# Altium project mini_greenhouse_hardware.PrjPcb
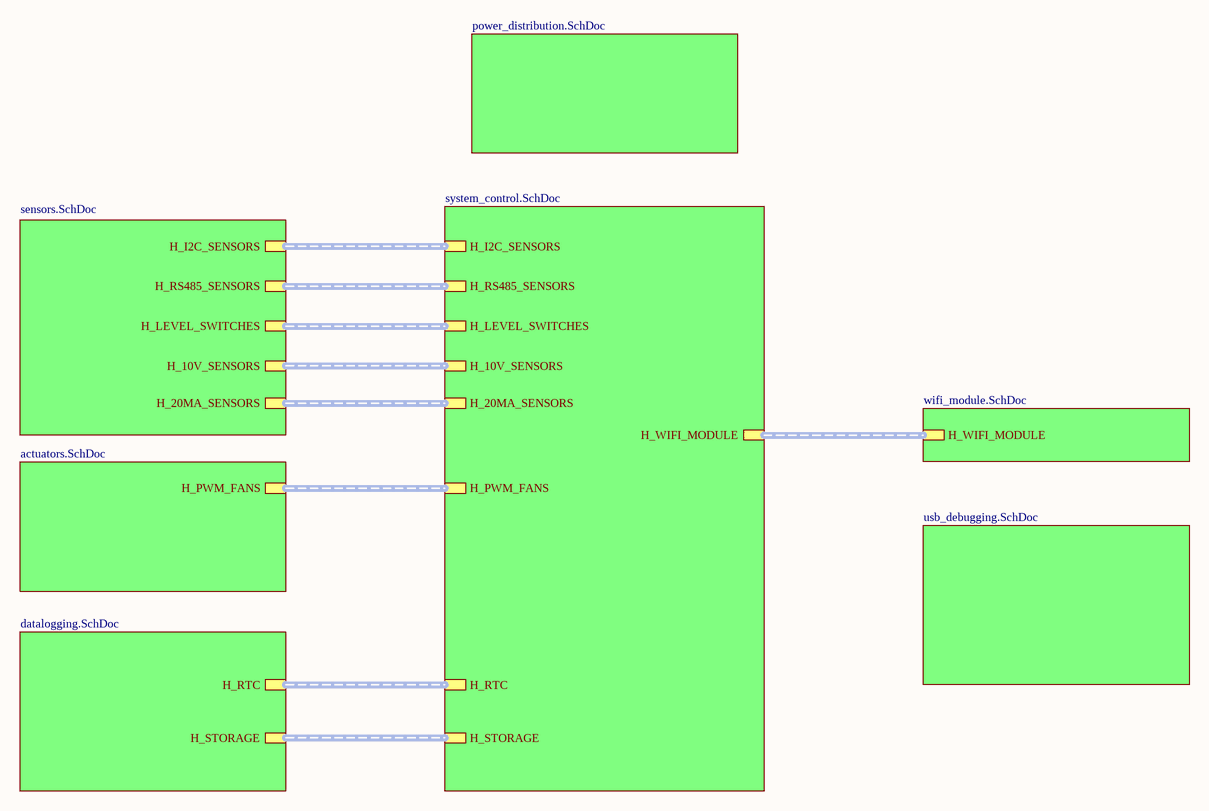
[diagram p0: main.SchDoc]
13 sheets, 113 parts. Net scope: hierarchical (ports join the sheet entries above them; power ports are global).
Sheets:
  main.SchDoc
    system_control = system_control.SchDoc
      mcu_core = mcu_core.SchDoc
    sensors = sensors.SchDoc
      soil_moisture_sensors = rs485_sensors.SchDoc
      level_switches = level_switches.SchDoc
      soil_moisture_sensors = i2c_sensors.SchDoc
      level_switches = analog_10V_sensors.SchDoc
      level_switches = analog_20mA_sensors.SchDoc
    wifi_module = wifi_module.SchDoc
    actuators = actuators.SchDoc
      pwm_fan_controller = pwm_fan_controller.SchDoc
    datalogging = datalogging.SchDoc

## Sheet main.SchDoc
size A4; SheetNumber: 1; SheetTotal: 13

### Sub-sheets
actuators = actuators.SchDoc: H_PWM_FANS (harness H_PWM_FANS)
datalogging = datalogging.SchDoc: H_RTC (harness H_RTC), H_STORAGE (harness H_STORAGE)
power_distribution = power_distribution.SchDoc (file not in this document): no entries
sensors = sensors.SchDoc: H_I2C_SENSORS (harness H_I2C_SENSORS), H_LEVEL_SWITCHES (harness H_LEVEL_SENSORS), H_RS485_SENSORS, H_10V_SENSORS (harness H_ANALOG_SENSORS), H_20MA_SENSORS (harness H_ANALOG_SENSORS)
system_control = system_control.SchDoc: H_I2C_SENSORS (harness H_I2C_SENSORS), H_LEVEL_SWITCHES (harness H_LEVEL_SWITCHES), H_RTC (harness H_RTC), H_STORAGE (harness H_STORAGE), H_RS485_SENSORS (harness H_RS485_SENSORS), H_10V_SENSORS (harness H_10V_SENSORS), H_20MA_SENSORS (harness H_20MA_SENSORS), H_PWM_FANS (harness H_PWM_FANS), H_WIFI_MODULE (harness H_WIFI_MODULE)
usb_debugging = usb_debugging.SchDoc (file not in this document): no entries
wifi_module = wifi_module.SchDoc: H_WIFI_MODULE (harness H_WIFI_MODULE)

### Buses and harness runs
harness sheet actuators/H_PWM_FANS = sheet system_control/H_PWM_FANS
harness sheet datalogging/H_RTC = sheet system_control/H_RTC
harness sheet datalogging/H_STORAGE = sheet system_control/H_STORAGE
harness sheet sensors/H_10V_SENSORS = sheet system_control/H_10V_SENSORS
harness sheet sensors/H_20MA_SENSORS = sheet system_control/H_20MA_SENSORS
harness sheet sensors/H_I2C_SENSORS = sheet system_control/H_I2C_SENSORS
harness sheet sensors/H_LEVEL_SWITCHES = sheet system_control/H_LEVEL_SWITCHES
harness sheet sensors/H_RS485_SENSORS = sheet system_control/H_RS485_SENSORS
harness sheet system_control/H_WIFI_MODULE = sheet wifi_module/H_WIFI_MODULE

## Sheet system_control.SchDoc
size A4; SheetNumber: 2; SheetTotal: 13
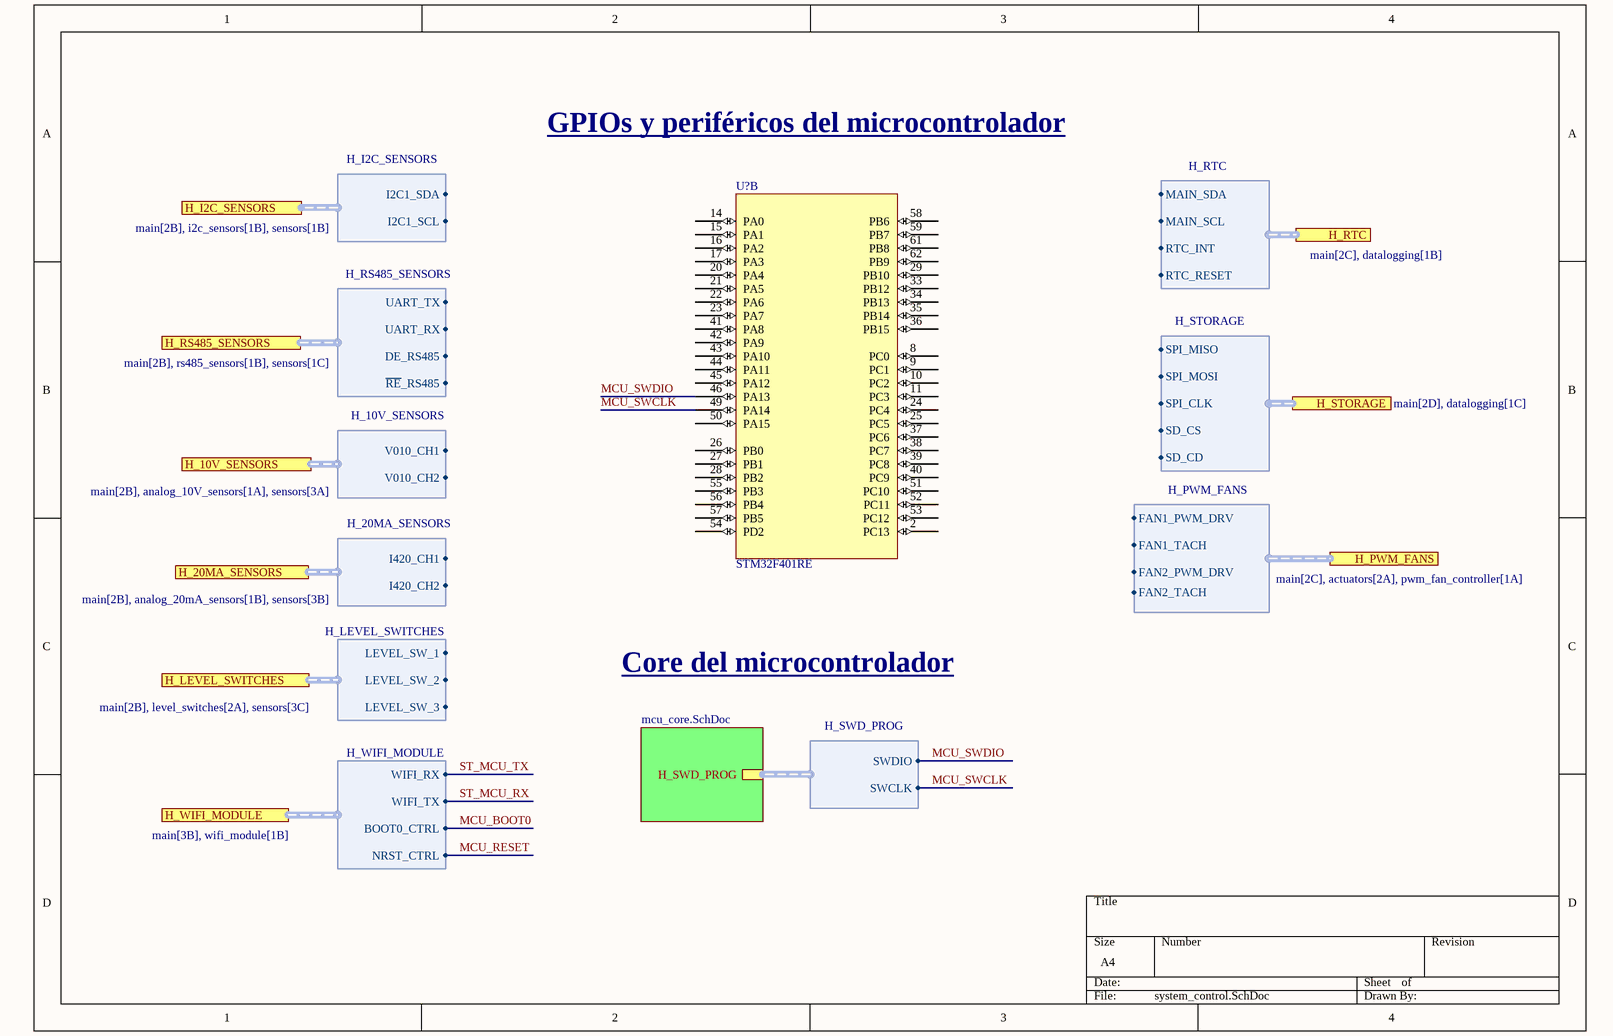
[diagram p1: system_control.SchDoc]

### Parts
(Parts that share a designator on the sheet are numbered #1, #2 ... from top to bottom, then left to right.)
U?#1  STM32F401RE  [FP-LQFP64-5W-IPC_B]  (part B of 2)

### Sub-sheets
mcu_core = mcu_core.SchDoc: H_SWD_PROG (harness H_SWD_PROG)

### Ports
H_10V_SENSORS (harness H_10V_SENSORS, see main[2B], analog_10V_sensors[1A], sensors[3A]), H_20MA_SENSORS (harness H_20MA_SENSORS, see main[2B], analog_20mA_sensors[1B], sensors[3B]), H_I2C_SENSORS (harness H_I2C_SENSORS, see main[2B], i2c_sensors[1B], sensors[1B]), H_LEVEL_SWITCHES (harness H_LEVEL_SWITCHES, see main[2B], level_switches[2A], sensors[3C]), H_PWM_FANS (harness H_PWM_FANS, see main[2C], actuators[2A], pwm_fan_controller[1A]), H_RS485_SENSORS (harness H_RS485_SENSORS, see main[2B], rs485_sensors[1B], sensors[1C]), H_RTC (harness H_RTC, see main[2C], datalogging[1B]), H_STORAGE (harness H_STORAGE, see main[2D], datalogging[1C]), H_WIFI_MODULE (harness H_WIFI_MODULE, see main[3B], wifi_module[1B])

### Harnesses
H_I2C_SENSORS: I2C1_SDA, I2C1_SCL
H_LEVEL_SWITCHES: LEVEL_SW_1, LEVEL_SW_2, LEVEL_SW_3
H_SWD_PROG: SWDIO, SWCLK
H_RTC: MAIN_SDA, MAIN_SCL, RTC_INT, RTC_RESET
H_STORAGE: SPI_MISO, SPI_MOSI, SPI_CLK, SD_CS, SD_CD
H_RS485_SENSORS: UART_TX, UART_RX, DE_RS485, ~{RE}_RS485
H_10V_SENSORS: V010_CH1, V010_CH2
H_20MA_SENSORS: I420_CH1, I420_CH2
H_PWM_FANS: FAN1_PWM_DRV, FAN1_TACH, FAN2_PWM_DRV, FAN2_TACH
H_WIFI_MODULE: WIFI_TX, WIFI_RX, BOOT0_CTRL, NRST_CTRL

### Nets
MCU_SWCLK: U?#1.49(PA14) ; sheet mcu_core/H_SWD_PROG.SWCLK
MCU_SWDIO: U?#1.46(PA13) ; sheet mcu_core/H_SWD_PROG.SWDIO

Not connected (* = marked no-connect by the designer): U?#1 2(PC13) 8(PC0) 9(PC1) 10(PC2) 11(PC3) 14(PA0) 15(PA1) 16(PA2) 17(PA3) 20(PA4) 21(PA5) 22(PA6) 23(PA7) 24(PC4) 25(PC5) 26(PB0) 27(PB1) 28(PB2) 29(PB10) 33(PB12) 34(PB13) 35(PB14) 36(PB15) 37(PC6) 38(PC7) 39(PC8) 40(PC9) 41(PA8) 42(PA9) 43(PA10) 44(PA11) 45(PA12) 50(PA15) 51(PC10) 52(PC11) 53(PC12) 54(PD2) 55(PB3) 56(PB4) 57(PB5) 58(PB6) 59(PB7) 61(PB8) 62(PB9)

### Notes on the sheet
- GPIOs y periféricos del microcontrolador
- Core del microcontrolador

## Sheet mcu_core.SchDoc
size A4; SheetNumber: 3; SheetTotal: 12
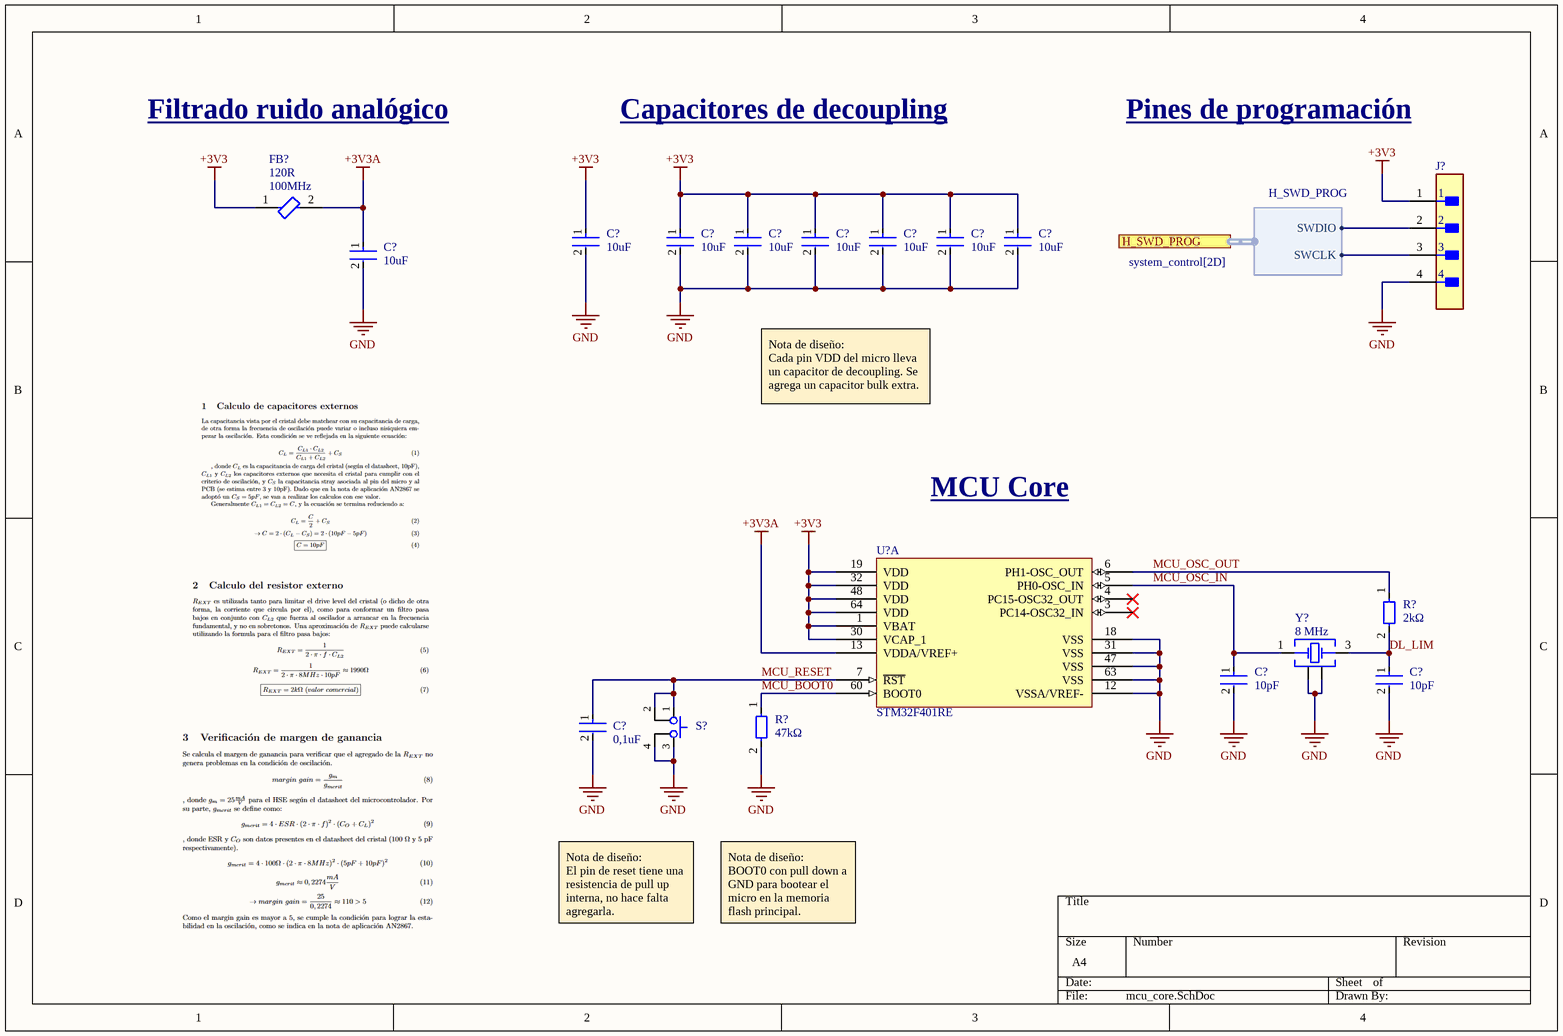
[diagram p2: mcu_core.SchDoc]

### Parts
(Parts that share a designator on the sheet are numbered #1, #2 ... from top to bottom, then left to right.)
C?#1  Capacitance: 10uF  [CAP_0805]  (hidden comment: Simbolo de capacitor genérico)
C?#2  Capacitance: 10uF  [CAP_0805]  (hidden comment: Simbolo de capacitor genérico)
C?#3  Capacitance: 10uF  [CAP_0805]  (hidden comment: Simbolo de capacitor genérico)
C?#4  Capacitance: 10uF  [CAP_0805]  (hidden comment: Simbolo de capacitor genérico)
C?#5  Capacitance: 10uF  [CAP_0805]  (hidden comment: Simbolo de capacitor genérico)
C?#6  Capacitance: 10uF  [CAP_0805]  (hidden comment: Simbolo de capacitor genérico)
C?#7  Capacitance: 10uF  [CAP_0805]  (hidden comment: Simbolo de capacitor genérico)
C?#8  Capacitance: 10uF  [CAP_0805]  (hidden comment: Simbolo de capacitor genérico)
C?#9  Capacitance: 10pF  [CAP_0805]  (hidden comment: Simbolo de capacitor genérico)
C?#10  Capacitance: 10pF  [CAP_0805]  (hidden comment: Simbolo de capacitor genérico)
C?#11  Capacitance: 0,1uF  [CAP_0805]  (hidden comment: Simbolo de capacitor genérico)
FB?  Test Frequency: 100MHz  Impedance: 120R  [FP-BLM21-0_2-t0_85-e0_5-IPC_A]  (hidden comment: BLM21BD121SN1D)
J?#1  HTSW-104-07-G-S  [FP-HTSW-104-07-G-S-MFG]  (value not drawn)
R?#1  value 2kΩ  [RES_0805]  (hidden comment: Simbolo de resistencia genérica)
R?#2  value 47kΩ  [RES_0805]  (hidden comment: Simbolo de resistencia genérica)
S?  Tactile push button 5,2mm x 5,2mm  [Switch Tactile 5,2mm x 5,2mm]  (value not drawn)
U?#2  STM32F401RE  [FP-LQFP64-5W-IPC_B]  (part A of 2)
Y?  Frequency: 8 MHz  [SMD5032-4P]  (hidden comment: Crystal SMD 4-P)

### Ports
H_SWD_PROG (harness H_SWD_PROG, see system_control[2D])

### Harnesses
H_SWD_PROG: SWDIO, SWCLK

### Nets
+3V3: C?#1.1 C?#2.1 C?#3.1 C?#4.1 C?#5.1 C?#6.1 C?#7.1 FB?.1 J?#1.1 U?#2.1(VBAT) U?#2.19(VDD) U?#2.30(VCAP_1) U?#2.32(VDD) U?#2.48(VDD) U?#2.64(VDD)
+3V3A: C?#8.1 FB?.2 U?#2.13(VDDA/VREF+)
GND: C?#1.2 C?#2.2 C?#3.2 C?#4.2 C?#5.2 C?#6.2 C?#7.2 C?#8.2 C?#9.2 C?#10.2 C?#11.2 J?#1.4 R?#2.2 S?.3 S?.4 U?#2.12(VSSA/VREF-) U?#2.18(VSS) U?#2.31(VSS) U?#2.47(VSS) U?#2.63(VSS) Y?.2(GND_&_Lid) Y?.4(GND_&_Lid)
DL_LIM: C?#10.1 R?#1.2 Y?.3(Crystal)
MCU_BOOT0: R?#2.1 U?#2.60(BOOT0)
MCU_OSC_IN: C?#9.1 U?#2.5(PH0-OSC_IN) Y?.1(Crystal)
MCU_OSC_OUT: R?#1.1 U?#2.6(PH1-OSC_OUT)
MCU_RESET: C?#11.1 S?.1 S?.2 U?#2.7(~{RST})
MCU_SWCLK: J?#1.3 ; port H_SWD_PROG.SWCLK
MCU_SWDIO: J?#1.2 ; port H_SWD_PROG.SWDIO

Not connected (* = marked no-connect by the designer): U?#2 3(PC14-OSC32_IN)* 4(PC15-OSC32_OUT)*

### Notes on the sheet
- Filtrado ruido analógico
- Capacitores de decoupling
- Pines de programación
- Nota de diseño:
  Cada pin VDD del micro lleva un capacitor de decoupling. Se agrega un capacitor bulk extra.
- MCU Core
- Nota de diseño:
  El pin de reset tiene una resistencia de pull up interna, no hace falta agregarla.
- Nota de diseño:
  BOOT0 con pull down a GND para bootear el micro en la memoria flash principal.

### Library data of the parts
C?#1-C?#11 = Generic C: Dielectric: X5R; Voltage Rating: 10V; Tolerance: 10%; Case Code (Imperial): 0805; Mount: Surface Mount; Depth: 1.25mm; Length: 2mm; Lead Free: Lead Free; Packaging: Tape and Reel; Width: 0.049inch; Package Quantity: 1; Height: 1.25mm; Case/Package: 0805; Thickness: 0.053inch; Max Operating Temperature: 85°C; Case Code (Metric): 2012; Contact Plating: Tin; Min Operating Temperature: -55°C; Radiation Hardening: No; Voltage Rating (DC): 10V
FB? = CMP-0686-00664-3: Chip Ferrite Bead, 0805, 120Ω @ 100MHz, 0.25Ω, 25%, 350mA; DC Resistance-Max: 250mR; Number of Lines: 1; Shielding: Unshielded; Current Rating: 200mA; Material: Steel; Max Operating Temperature: 125°C; Tolerance: 25%; DC Resistance (DCR): 250mR; REACH SVHC: No SVHC; Packaging: Tape and Reel; Package Quantity: 1; Depth: 1.25mm; Max DC Current: 200mA; Termination: SMD/SMT; Number of Circuits: 1; Lead Free: Lead Free; Case Code (Imperial): 0805; Height: 0.85mm; Number of Pins: 2; Series: BLM21B; Length: 2mm; Max Current Rating: 350mA; Case Code (Metric): 2012; Width: 1.25mm; Core Material: Ferrite; Min Operating Temperature: -55°C; Frequency: 100MHz; Case/Package: 0805
J?#1 = CMP-02766-001776-1: CONN HEADER VERT 4POS 2.54MM; Gender: Male; Number of Contacts: 4; Packaging: Bulk; RoHS Compliant: Yes; Number of Rows: 1; Mount: Through Hole; Contact Material: Bronze; Series: HTSW; Radiation Hardening: No; Pitch: 2.54mm; Reach SVHC Compliant: Yes; Contact Plating: Gold; Termination: Through Hole
R?#1 R?#2 = Generic R
S? = Tactile push button 5,2mm x 5,2mm: Switch Tactile SPST-NO 5,2mm x 5,2mm
Y? = Crystal SMD 4-P: Cristal SMD 4-P genérico; Manufacturer part: SX5B8.000F1020F30; Manufacturer: Shenzhen SCTF Elec; CL: 10 pF; ESR: 100 Ω; Datasheet: https://jlcpcb.com/api/file/downloadByFileSystemAccessId/8590208237112238080; Package: SMD5032-4P

## Sheet sensors.SchDoc
size A4; SheetNumber: 4; SheetTotal: 11
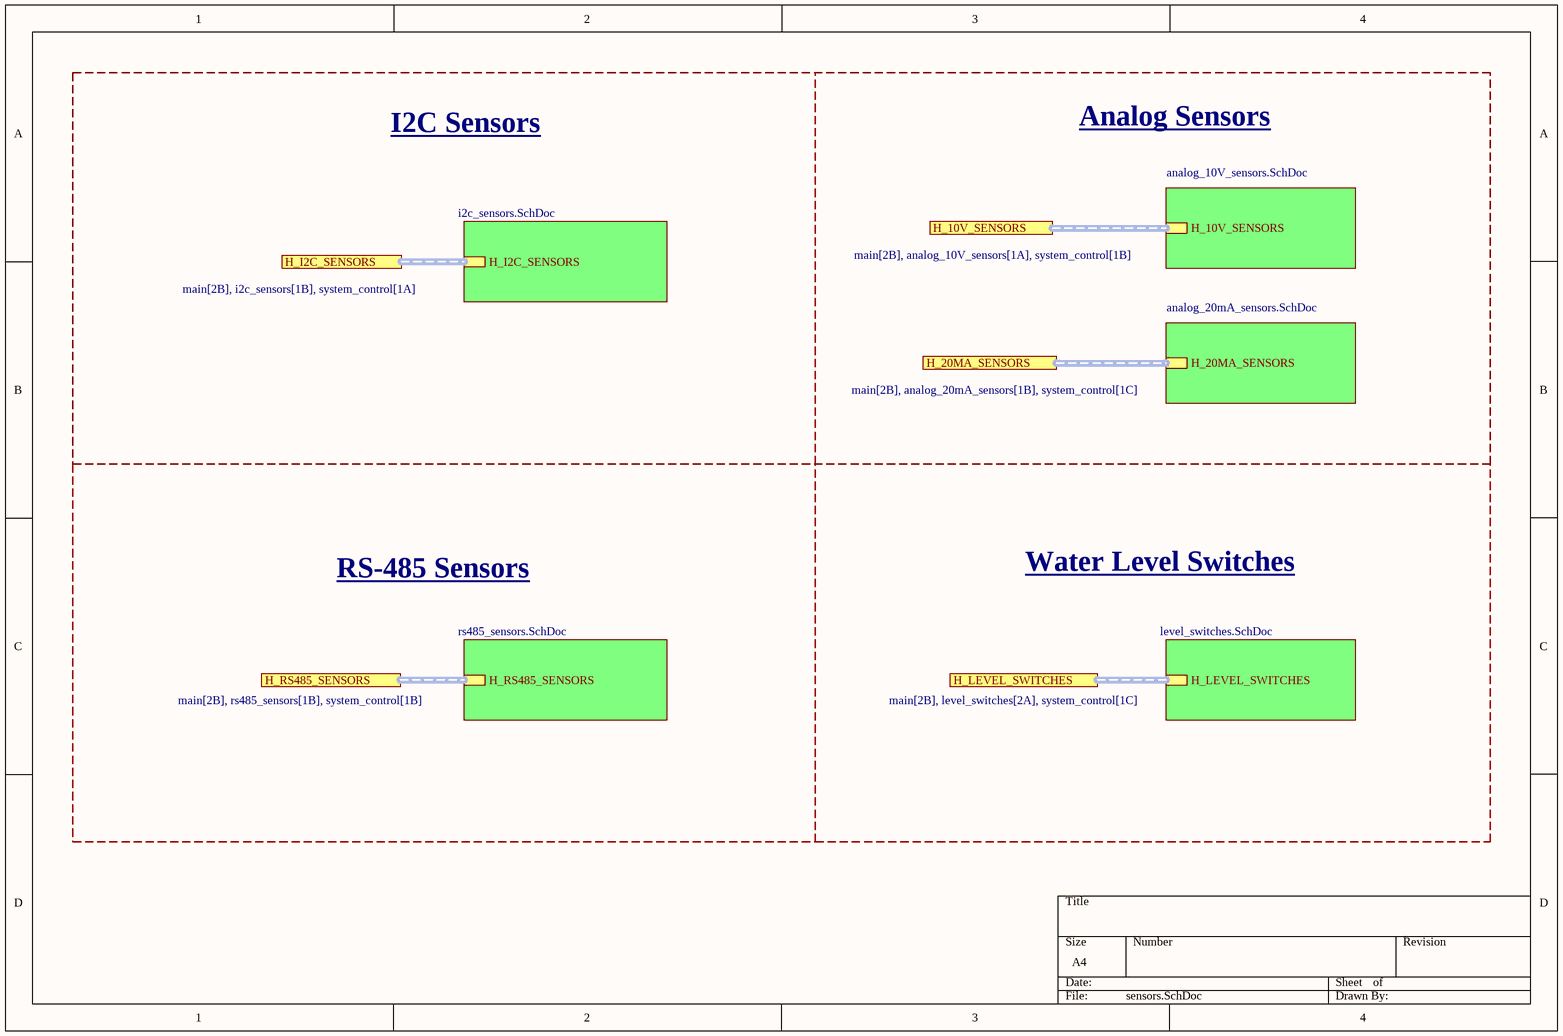
[diagram p3: sensors.SchDoc]

### Sub-sheets
level_switches = level_switches.SchDoc: H_LEVEL_SWITCHES (harness H_LEVEL_SWITCHES)
level_switches = analog_10V_sensors.SchDoc: H_10V_SENSORS (harness H_10V_SENSORS)
level_switches = analog_20mA_sensors.SchDoc: H_20MA_SENSORS (harness H_20MA_SENSORS)
soil_moisture_sensors = rs485_sensors.SchDoc: H_RS485_SENSORS (harness H_RS485_SENSORS)
soil_moisture_sensors = i2c_sensors.SchDoc: H_I2C_SENSORS (harness H_I2C_SENSORS)

### Ports
H_10V_SENSORS (harness H_ANALOG_SENSORS, see main[2B], analog_10V_sensors[1A], system_control[1B]), H_20MA_SENSORS (harness H_ANALOG_SENSORS, see main[2B], analog_20mA_sensors[1B], system_control[1C]), H_I2C_SENSORS (harness H_I2C_SENSORS, see main[2B], i2c_sensors[1B], system_control[1A]), H_LEVEL_SWITCHES (harness H_LEVEL_SENSORS, see main[2B], level_switches[2A], system_control[1C]), H_RS485_SENSORS (see main[2B], rs485_sensors[1B], system_control[1B])

### Buses and harness runs
harness port H_10V_SENSORS = sheet level_switches/H_10V_SENSORS
harness port H_20MA_SENSORS = sheet level_switches/H_20MA_SENSORS
harness port H_I2C_SENSORS = sheet soil_moisture_sensors/H_I2C_SENSORS
harness port H_LEVEL_SWITCHES = sheet level_switches/H_LEVEL_SWITCHES
harness port H_RS485_SENSORS = sheet soil_moisture_sensors/H_RS485_SENSORS

### Notes on the sheet
- I2C Sensors
- Analog Sensors
- RS-485 Sensors
- Water Level Switches

## Sheet rs485_sensors.SchDoc
size A4; SheetNumber: 5; SheetTotal: 13
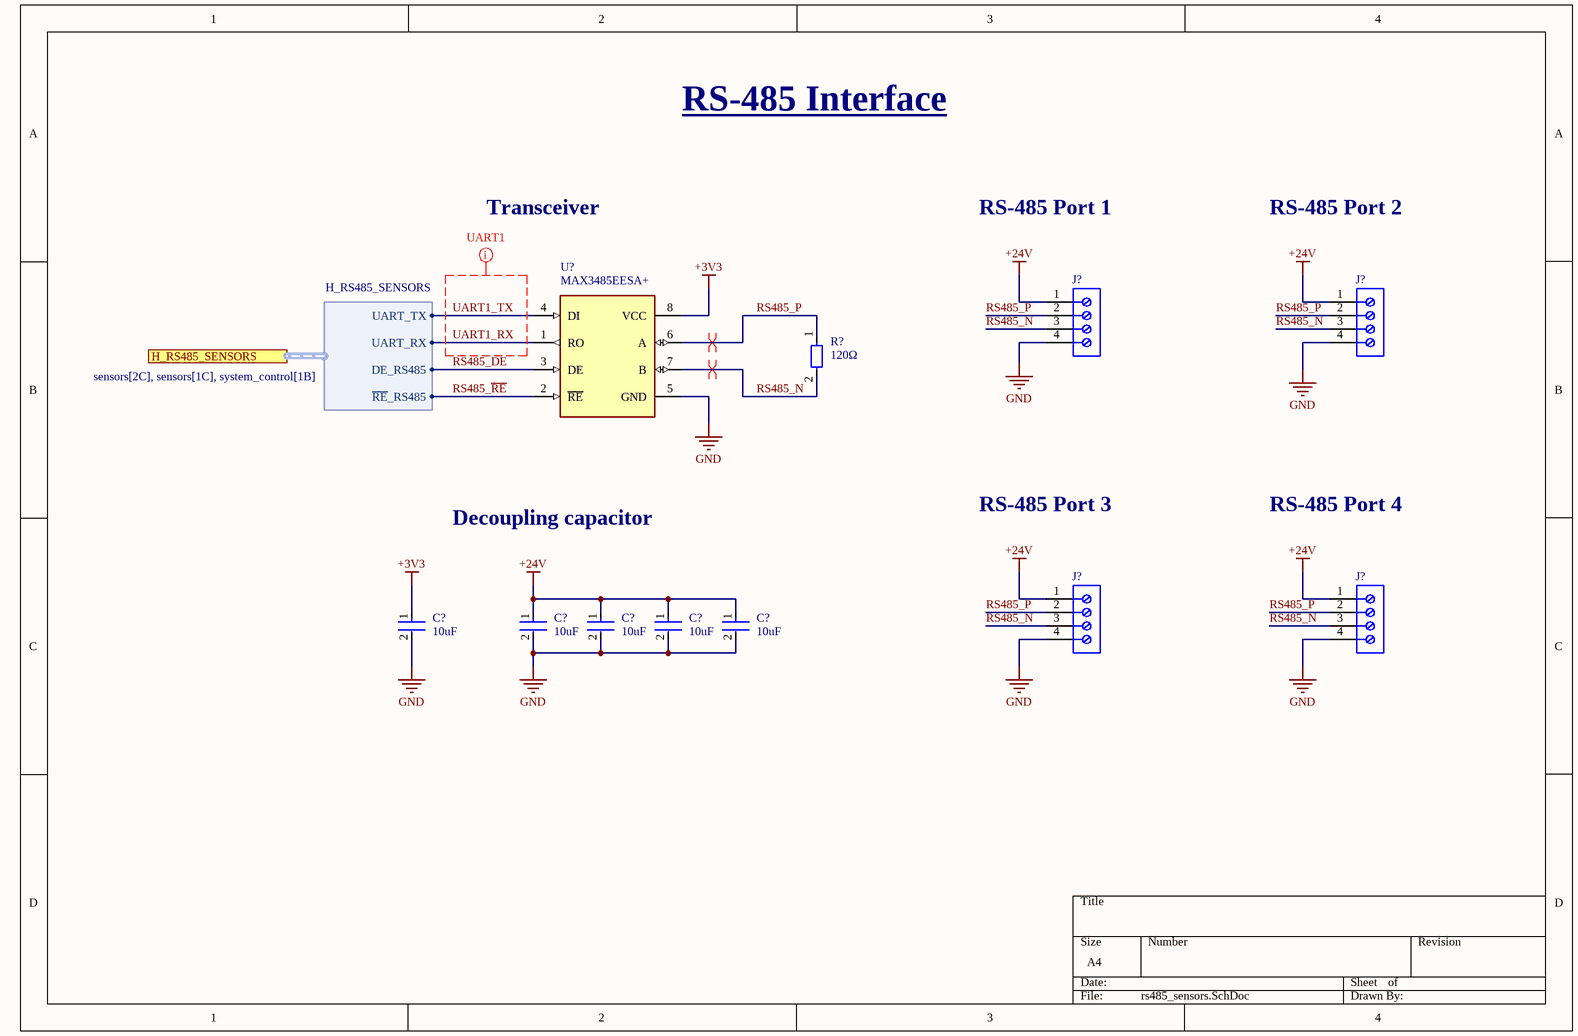
[diagram p4: rs485_sensors.SchDoc]

### Parts
(Parts that share a designator on the sheet are numbered #1, #2 ... from top to bottom, then left to right.)
C?#12  Capacitance: 10uF  [CAP_0805]  (hidden comment: Simbolo de capacitor genérico)
C?#13  Capacitance: 10uF  [CAP_0805]  (hidden comment: Simbolo de capacitor genérico)
C?#14  Capacitance: 10uF  [CAP_0805]  (hidden comment: Simbolo de capacitor genérico)
C?#15  Capacitance: 10uF  [CAP_0805]  (hidden comment: Simbolo de capacitor genérico)
C?#16  Capacitance: 10uF  [CAP_0805]  (hidden comment: Simbolo de capacitor genérico)
J?#2  691137710004  [691137710004]  (value not drawn)
J?#3  691137710004  [691137710004]  (value not drawn)
J?#4  691137710004  [691137710004]  (value not drawn)
J?#5  691137710004  [691137710004]  (value not drawn)
R?#3  value 120Ω  [RES_0805]  (hidden comment: Simbolo de resistencia genérica)
U?#3  MAX3485EESA+  [SOIC8]

### Ports
H_RS485_SENSORS (harness H_RS485_SENSORS, see sensors[2C], sensors[1C], system_control[1B])

### Harnesses
H_RS485_SENSORS: UART_TX, UART_RX, DE_RS485, ~{RE}_RS485

### Nets
+3V3: C?#12.1 U?#3.8(VCC)
+24V: C?#13.1 C?#14.1 C?#15.1 C?#16.1 J?#2.1 J?#3.1 J?#4.1 J?#5.1
GND: C?#12.2 C?#13.2 C?#14.2 C?#15.2 C?#16.2 J?#2.4 J?#3.4 J?#4.4 J?#5.4 U?#3.5(GND)
RS485_DE: U?#3.3(DE) ; port H_RS485_SENSORS.DE_RS485
RS485_N: J?#2.3 J?#3.3 J?#4.3 J?#5.3 R?#3.2 U?#3.7(B)
RS485_P: J?#2.2 J?#3.2 J?#4.2 J?#5.2 R?#3.1 U?#3.6(A)
RS485_~{RE}: U?#3.2(~{RE}) ; port H_RS485_SENSORS.~{RE}_RS485
UART1_RX: U?#3.1(RO) ; port H_RS485_SENSORS.UART_RX
UART1_TX: U?#3.4(DI) ; port H_RS485_SENSORS.UART_TX

### Layout directives
differential pair; differential pair class RS485: RS485_N, RS485_P
net class UART1: UART1_RX, UART1_TX

### Notes on the sheet
- RS-485 Interface
- Transceiver
- RS-485 Port 1
- RS-485 Port 2
- RS-485 Port 3
- RS-485 Port 4
- Decoupling capacitor

### Library data of the parts
C?#12-C?#16 = Generic C: as C?#1 on sheet mcu_core; Case Code (Imperial): 0805; Mount: Surface Mount; Depth: 1.25mm; Length: 2mm; Lead Free: Lead Free; Packaging: Tape and Reel; Width: 0.049inch; Package Quantity: 1; Height: 1.25mm; Case/Package: 0805; Thickness: 0.053inch; Max Operating Temperature: 85°C; Case Code (Metric): 2012; Contact Plating: Tin; Min Operating Temperature: -55°C; Radiation Hardening: No; Voltage Rating (DC): 10V
J?#2-J?#5 = CMP-1502-03326-2: NexarPartId: 78871140; Packaging: Box; RoHS: Non-Compliant; Number of Pins: 4; Lead Pitch: 5mm
R?#3 = Generic R
U?#3 = MAX3485EESA+: Low-power, 3.3V RS-485/RS-422 Transceiver, Half-Duplex; Manufacturer: Maxim Integrated / Analog Devices; MPN: MAX3485ESA+T; Interface: RS-485, RS-422; Number of transmitters: 1; Min Supply Voltage: 3V; Max Supply Voltage: 3.6V; Data rate: 10 Mbps; Number of receivers: 1; Operating temperature range: -40°C to +85°C; Datasheet: https://www.analog.com/media/en/technical-documentation/data-sheets/MAX3483-MAX3491.pdf

## Sheet level_switches.SchDoc
size A4; SheetNumber: 8; SheetTotal: 12
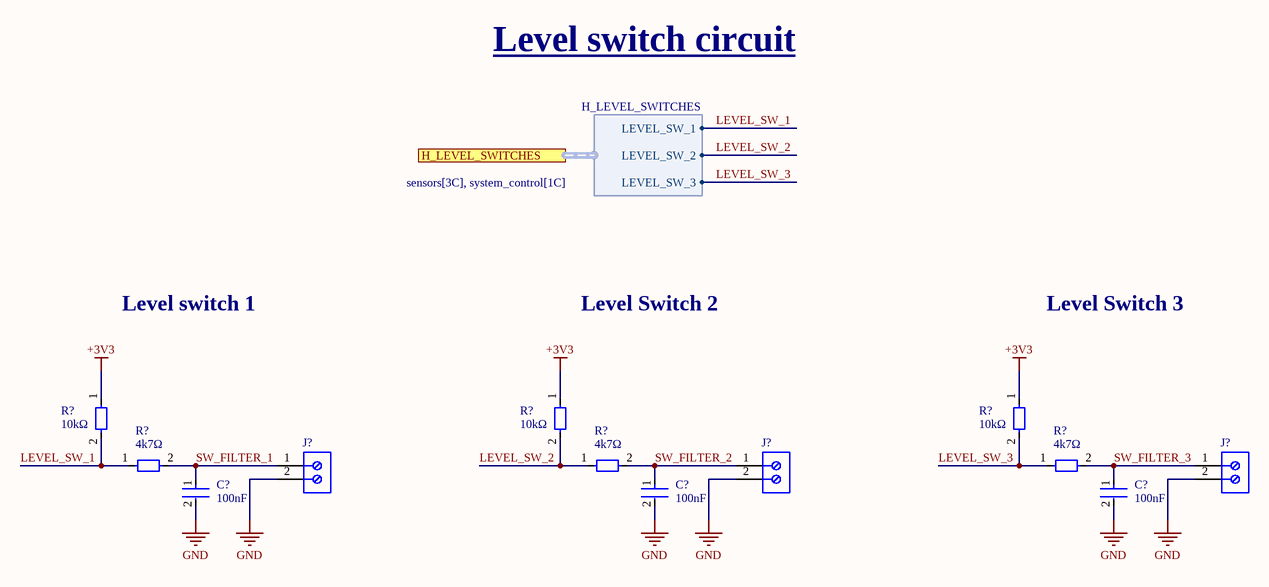
[diagram p5: level_switches.SchDoc]

### Parts
(Parts that share a designator on the sheet are numbered #1, #2 ... from top to bottom, then left to right.)
C?#17  Capacitance: 100nF  [CAP_0805]  (hidden comment: Simbolo de capacitor genérico)
C?#18  Capacitance: 100nF  [CAP_0805]  (hidden comment: Simbolo de capacitor genérico)
C?#19  Capacitance: 100nF  [CAP_0805]  (hidden comment: Simbolo de capacitor genérico)
J?#6  691137710002  [691137710002]  (value not drawn)
J?#7  691137710002  [691137710002]  (value not drawn)
J?#8  691137710002  [691137710002]  (value not drawn)
R?#4  value 10kΩ  [RES_0805]  (hidden comment: Simbolo de resistencia genérica)
R?#5  value 10kΩ  [RES_0805]  (hidden comment: Simbolo de resistencia genérica)
R?#6  value 10kΩ  [RES_0805]  (hidden comment: Simbolo de resistencia genérica)
R?#7  value 4k7Ω  [RES_0805]  (hidden comment: Simbolo de resistencia genérica)
R?#8  value 4k7Ω  [RES_0805]  (hidden comment: Simbolo de resistencia genérica)
R?#9  value 4k7Ω  [RES_0805]  (hidden comment: Simbolo de resistencia genérica)

### Ports
H_LEVEL_SWITCHES (harness H_LEVEL_SWITCHES, see sensors[3C], system_control[1C])

### Harnesses
H_LEVEL_SWITCHES: LEVEL_SW_1, LEVEL_SW_2, LEVEL_SW_3

### Nets
+3V3: R?#4.1 R?#5.1 R?#6.1
GND: C?#17.2 C?#18.2 C?#19.2 J?#6.2 J?#7.2 J?#8.2
LEVEL_SW_1: R?#4.2 R?#7.1 ; port H_LEVEL_SWITCHES.LEVEL_SW_1
LEVEL_SW_2: R?#5.2 R?#8.1 ; port H_LEVEL_SWITCHES.LEVEL_SW_2
LEVEL_SW_3: R?#6.2 R?#9.1 ; port H_LEVEL_SWITCHES.LEVEL_SW_3
SW_FILTER_1: C?#17.1 J?#6.1 R?#7.2
SW_FILTER_2: C?#18.1 J?#7.1 R?#8.2
SW_FILTER_3: C?#19.1 J?#8.1 R?#9.2

### Notes on the sheet
- Level switch circuit
- Level switch 1
- Level Switch 2
- Level Switch 3

### Library data of the parts
C?#17-C?#19 = Generic C: as C?#1 on sheet mcu_core; Case Code (Imperial): 0805; Mount: Surface Mount; Depth: 1.25mm; Length: 2mm; Lead Free: Lead Free; Packaging: Tape and Reel; Width: 0.049inch; Package Quantity: 1; Height: 1.25mm; Case/Package: 0805; Thickness: 0.053inch; Max Operating Temperature: 85°C; Case Code (Metric): 2012; Contact Plating: Tin; Min Operating Temperature: -55°C; Radiation Hardening: No; Voltage Rating (DC): 10V
J?#6-J?#8 = CMP-1502-03324-2: NexarPartId: 78871135; Voltage Rating: 300V; Number of Contacts: 2; Current Rating: 16A; Lead Pitch: 5mm; Height: 11.6mm; Packaging: Box; RoHS: Non-Compliant; Contact Material: Nickel, Tin; Max Operating Temperature: 120°C; Number of Pins: 2; Min Operating Temperature: -30°C; Number of Rows: 1
R?#4-R?#9 = Generic R

## Sheet i2c_sensors.SchDoc
size A4; SheetNumber: 7; SheetTotal: 13
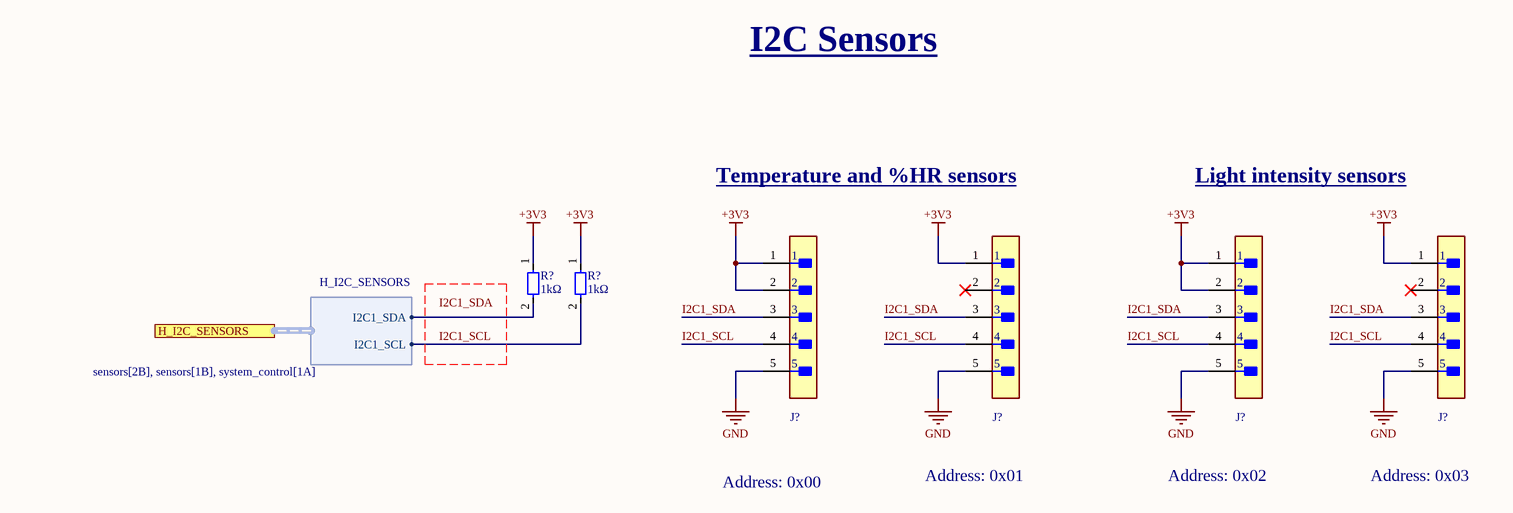
[diagram p6: i2c_sensors.SchDoc]

### Parts
(Parts that share a designator on the sheet are numbered #1, #2 ... from top to bottom, then left to right.)
J?#9  0022272051  [CONN_MOLEX_KK_5POS_2,54]  (value not drawn)
J?#10  0022272051  [CONN_MOLEX_KK_5POS_2,54]  (value not drawn)
J?#11  0022272051  [CONN_MOLEX_KK_5POS_2,54]  (value not drawn)
J?#12  0022272051  [CONN_MOLEX_KK_5POS_2,54]  (value not drawn)
R?#10  value 1kΩ  [RES_0805]  (hidden comment: Simbolo de resistencia genérica)
R?#11  value 1kΩ  [RES_0805]  (hidden comment: Simbolo de resistencia genérica)

### Ports
H_I2C_SENSORS (harness H_I2C_SENSORS, see sensors[2B], sensors[1B], system_control[1A])

### Harnesses
H_I2C_SENSORS: I2C1_SDA, I2C1_SCL

### Nets
+3V3: J?#9.1 J?#9.2 J?#10.1 J?#11.1 J?#11.2 J?#12.1 R?#10.1 R?#11.1
GND: J?#9.5 J?#10.5 J?#11.5 J?#12.5
I2C1_SCL: J?#9.4 J?#10.4 J?#11.4 J?#12.4 R?#11.2 ; port H_I2C_SENSORS.I2C1_SCL
I2C1_SDA: J?#9.3 J?#10.3 J?#11.3 J?#12.3
NetR?#10_2: R?#10.2 ; port H_I2C_SENSORS.I2C1_SDA

Not connected (* = marked no-connect by the designer): J?#10 2*; J?#12 2*

### Notes on the sheet
- I2C Sensors
- Temperature and %HR sensors
- Light intensity sensors
- Address: 0x00
- Address: 0x01
- Address: 0x02
- Address: 0x03
- Labels drawn without touching a wire or pin: I2C1_SDA

### Library data of the parts
J?#9-J?#12 = CONN_MOLEX_KK_5POS_2,54MM: CONN HEADER VERT 5POS 2.54MM MOLEX KK; Insulation Resistance: 50GR; Voltage Rating: 250V; Glow Wire Compliant: Non-compliant; Max Current Rating: 4A; Number of Circuits: 5; Contact Resistance: 10mR; Gender: Male; Number of Lines: 1; Length: 10.16mm; Radiation Hardening: No; Pitch: 2.54mm; Contact Material: Brass; Height: 11.7mm; Max Operating Temperature: 75°C; Flammability Rating: UL94 V-0; Mount: Through Hole; Voltage Rating (DC): 250V; Halogen Free: Low Halogen; Housing Color: White; Package Quantity: 1500; Series: KK® 6410; Number of Rows: 1; Housing Material: Nylon; Depth: 5.8mm; RoHS Compliant: Yes; Orientation: Straight; Contact Gender: Male; Color: Natural; Current Rating: 4A; Contact Mating Length: 0.295inch; Number of Poles: 5; Packaging: Bulk; Contact Type: Male Pin; Termination: Solder; Number of Positions: 5; Number of Contacts: 5; Lead Free: Lead Free; Min Operating Temperature: 0°C; Fastening Type: Friction; Contact Plating: Gold
R?#10 R?#11 = Generic R

## Sheet analog_10V_sensors.SchDoc
size A4; SheetNumber: 6; SheetTotal: 12
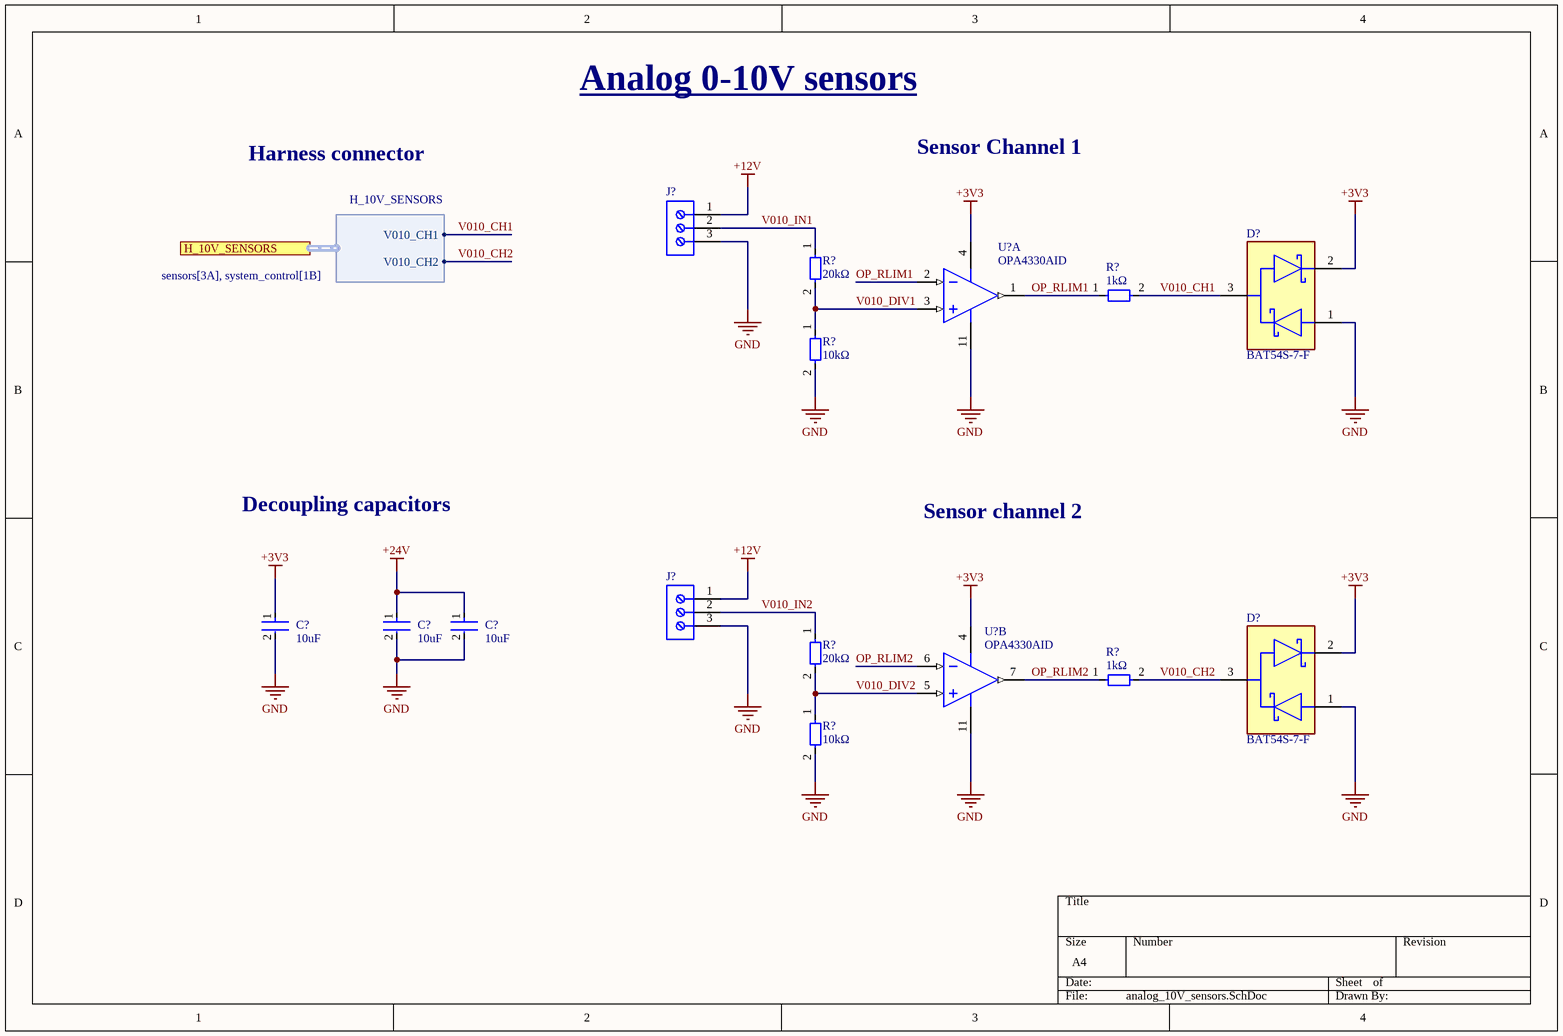
[diagram p7: analog_10V_sensors.SchDoc]

### Parts
(Parts that share a designator on the sheet are numbered #1, #2 ... from top to bottom, then left to right.)
C?#20  Capacitance: 10uF  [CAP_0805]  (hidden comment: Simbolo de capacitor genérico)
C?#21  Capacitance: 10uF  [CAP_0805]  (hidden comment: Simbolo de capacitor genérico)
C?#22  Capacitance: 10uF  [CAP_0805]  (hidden comment: Simbolo de capacitor genérico)
D?#1  BAT54S-7-F  [FP-SOT23-MFG]
D?#2  BAT54S-7-F  [FP-SOT23-MFG]
J?#13  691137710003  [691137710003]  (value not drawn)
J?#14  691137710003  [691137710003]  (value not drawn)
R?#12  value 20kΩ  [RES_0805]  (hidden comment: Simbolo de resistencia genérica)
R?#13  value 1kΩ  [RES_0805]  (hidden comment: Simbolo de resistencia genérica)
R?#14  value 10kΩ  [RES_0805]  (hidden comment: Simbolo de resistencia genérica)
R?#15  value 20kΩ  [RES_0805]  (hidden comment: Simbolo de resistencia genérica)
R?#16  value 1kΩ  [RES_0805]  (hidden comment: Simbolo de resistencia genérica)
R?#17  value 10kΩ  [RES_0805]  (hidden comment: Simbolo de resistencia genérica)
U?#4  OPA4330AID  [D0014A_N]  (part A of 4)
U?#5  OPA4330AID  [D0014A_N]  (part B of 4)

### Ports
H_10V_SENSORS (harness H_10V_SENSORS, see sensors[3A], system_control[1B])

### Harnesses
H_10V_SENSORS: V010_CH1, V010_CH2

### Nets
+3V3: C?#20.1 D?#1.2 D?#2.2 U?#4.4(V+) U?#5.4(V+)
+12V: J?#13.1 J?#14.1
+24V: C?#21.1 C?#22.1
GND: C?#20.2 C?#21.2 C?#22.2 D?#1.1 D?#2.1 J?#13.3 J?#14.3 R?#14.2 R?#17.2 U?#4.11(V-) U?#5.11(V-)
OP_RLIM1: R?#13.1 U?#4.1(OUT_A) U?#4.2(IN_A-)
OP_RLIM2: R?#16.1 U?#5.6(IN_B-) U?#5.7(OUT_B)
V010_CH1: D?#1.3 R?#13.2 ; port H_10V_SENSORS.V010_CH1
V010_CH2: D?#2.3 R?#16.2 ; port H_10V_SENSORS.V010_CH2
V010_DIV1: R?#12.2 R?#14.1 U?#4.3(IN_A+)
V010_DIV2: R?#15.2 R?#17.1 U?#5.5(IN_B+)
V010_IN1: J?#13.2 R?#12.1
V010_IN2: J?#14.2 R?#15.1

### Notes on the sheet
- Analog 0-10V sensors
- Harness connector
- Sensor Channel 1
- Decoupling capacitors
- Sensor channel 2

### Library data of the parts
C?#20-C?#22 = Generic C: as C?#1 on sheet mcu_core; Case Code (Imperial): 0805; Mount: Surface Mount; Depth: 1.25mm; Length: 2mm; Lead Free: Lead Free; Packaging: Tape and Reel; Width: 0.049inch; Package Quantity: 1; Height: 1.25mm; Case/Package: 0805; Thickness: 0.053inch; Max Operating Temperature: 85°C; Case Code (Metric): 2012; Contact Plating: Tin; Min Operating Temperature: -55°C; Radiation Hardening: No; Voltage Rating (DC): 10V
D?#1 D?#2 = CMP-1667-00006-2: DIODE ARRAY SCHOTTKY 30V SOT23-3; Forward Voltage: 800mV; Reverse Recovery Time: 5ns; Peak Non-Repetitive Surge Current: 600mA; Power Rating: 200mW; Current Rating: 200mA; Peak Reverse Current: 2uA; Capacitance: 10pF; Width: 1.3mm; Mount: Surface Mount; Height: 1mm; Number of Pins: 3; Weight: 0.000282oz; Max Reverse Voltage (DC): 30V; Max Power Dissipation: 200mW; Lead Free: Lead Free; Max Operating Temperature: 150°C; Min Operating Temperature: -65°C; Package Quantity: 3000; REACH SVHC: No SVHC; Termination: SMD/SMT; Max Forward Surge Current (Ifsm): 600mA; Radiation Hardening: No; Voltage Rating (DC): 30V; Average Rectified Current: 200mA; Max Repetitive Reverse Voltage (Vrrm): 30V; Contact Plating: Tin; Case/Package: SOT-23; Forward Current: 200mA; Power Dissipation: 200mW; Length: 2.9mm; Packaging: Tape and Reel
J?#13 J?#14 = CMP-1502-03325-2: NexarPartId: 78871138; Number of Pins: 3; Packaging: Box; RoHS: Non-Compliant; Lead Pitch: 5mm
R?#12-R?#17 = Generic R
U?#4 U?#5 = CMP-0272-00094-3: MicroPower, Precision, Zero Drift CMOS Operational Amplifier, 1.8 to 5.5 V, -40 to 125 degC, 14-pin SOIC (D14), Green (RoHS & no Sb/Br); Manufacturer: Texas Instruments; Iq per channel(Max)(mA): 0.035; Vio (25C)(Max)(mV): 0.05; Total Supply Voltage(Min)(+5V is 5, +/-5V is 10): 1.8; IIB(Max)(pA): 300; Number of Channels: 4; Total Supply Voltage(Max)(+5V is 5, +/-5V is 10): 5.5; Slew Rate(Typ)(V/us): 0.16; Offset Drift(Typ)(uV/C): 0.02; Vn at 1kHz(Typ)(nV/rtHz): 55; Sub Family: Low Offset Voltage Amplifier (<=500uV), Low Power Amp (<=500uA), Low Supply Voltage Amplifier (<=2.7V), Precision Amplifier; CMRR(Min)(dB): 100; ComponentLink2URL: http://www.ti.com/general/docs/lit/getliterature.tsp?genericPartNumber=OPA4330&fileType=pdf; PackageReference: D0014A; ComponentLink1Description: Manufacturer URL; ComponentLink1URL: http://www.ti.com/; PartNumber: OPA4330AID; ComponentLink2Description: Datasheet; DatasheetVersion: SBOS432E; Eco-Plan: Green (RoHS & no Sb/Br); ComponentLink3URL: http://www.ti.com/lit/ml/mpds177g/mpds177g.pdf; Mounting Technology: Surface Mount; ComponentLink3Description: Package Specification; PackageVersion: 4040047-5/M, 06/2011; PackageDescription: 14-Pin Plastic Small Outline, Body 8.65 x 3.9 mm, Pitch 1.27 mm; Code_JEDEC: MS-012

## Sheet analog_20mA_sensors.SchDoc
size A4; SheetNumber: 9; SheetTotal: 13
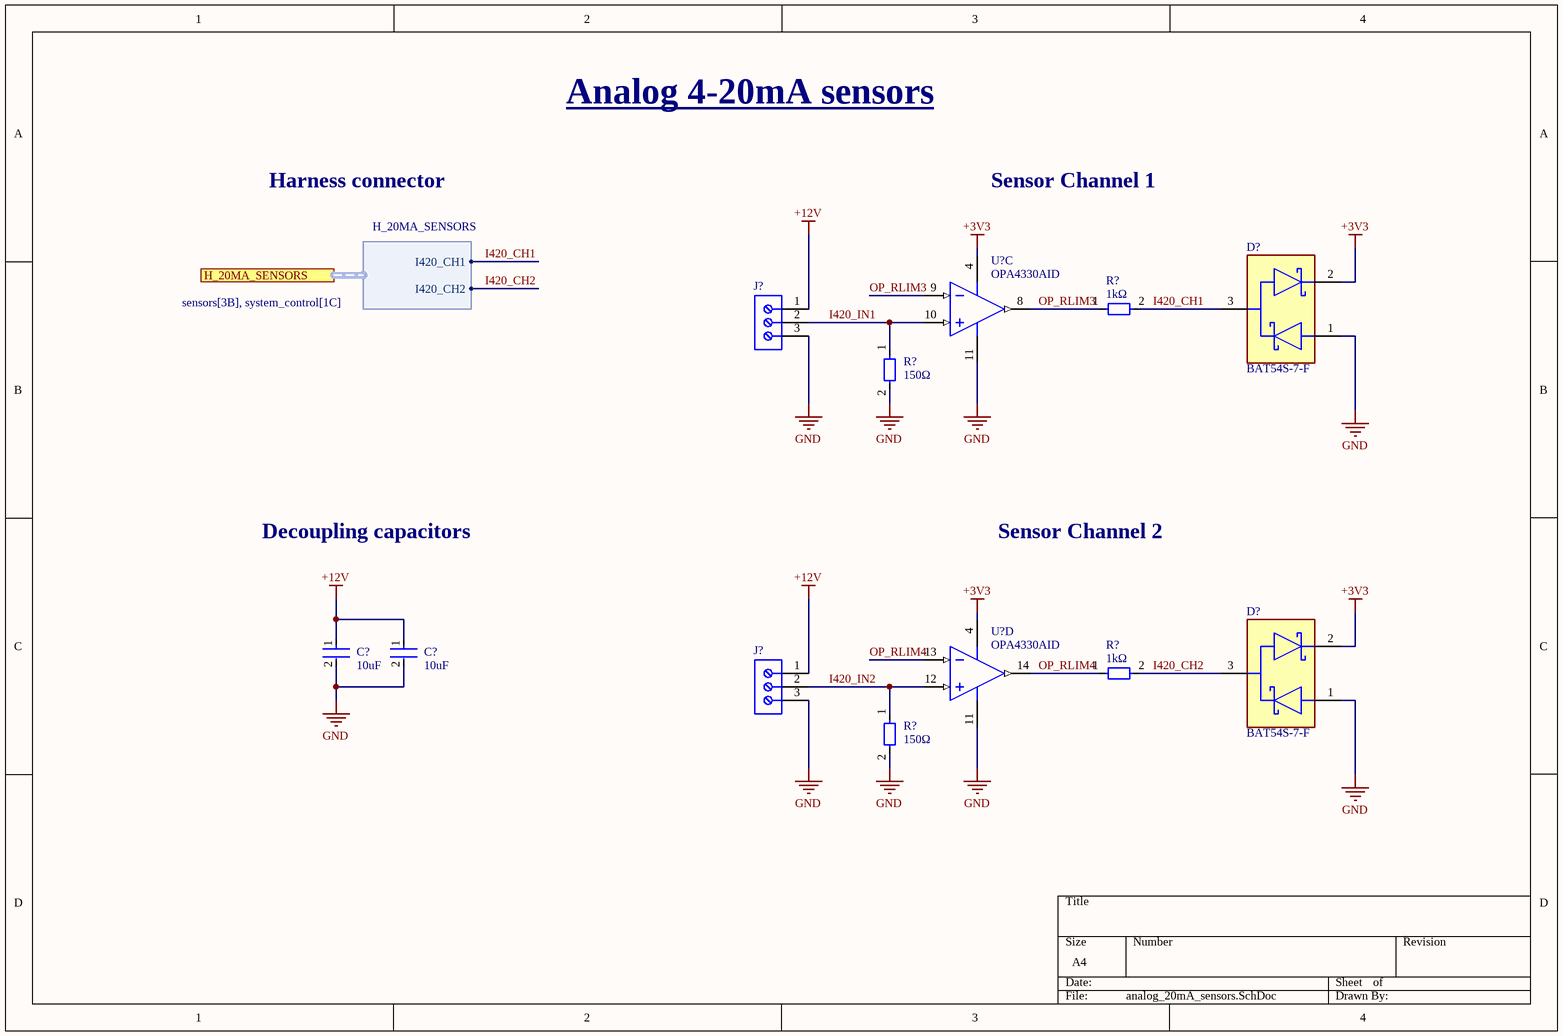
[diagram p8: analog_20mA_sensors.SchDoc]

### Parts
(Parts that share a designator on the sheet are numbered #1, #2 ... from top to bottom, then left to right.)
C?#23  Capacitance: 10uF  [CAP_0805]  (hidden comment: Simbolo de capacitor genérico)
C?#24  Capacitance: 10uF  [CAP_0805]  (hidden comment: Simbolo de capacitor genérico)
D?#3  BAT54S-7-F  [FP-SOT23-MFG]
D?#4  BAT54S-7-F  [FP-SOT23-MFG]
J?#15  691137710003  [691137710003]  (value not drawn)
J?#16  691137710003  [691137710003]  (value not drawn)
R?#18  value 1kΩ  [RES_0805]  (hidden comment: Simbolo de resistencia genérica)
R?#19  value 150Ω  [RES_0805]  (hidden comment: Simbolo de resistencia genérica)
R?#20  value 1kΩ  [RES_0805]  (hidden comment: Simbolo de resistencia genérica)
R?#21  value 150Ω  [RES_0805]  (hidden comment: Simbolo de resistencia genérica)
U?#6  OPA4330AID  [D0014A_N]  (part C of 4)
U?#7  OPA4330AID  [D0014A_N]  (part D of 4)

### Ports
H_20MA_SENSORS (harness H_20MA_SENSORS, see sensors[3B], system_control[1C])

### Harnesses
H_20MA_SENSORS: I420_CH1, I420_CH2

### Nets
+3V3: D?#3.2 D?#4.2 U?#6.4(V+) U?#7.4(V+)
+12V: C?#23.1 C?#24.1 J?#15.1 J?#16.1
GND: C?#23.2 C?#24.2 D?#3.1 D?#4.1 J?#15.3 J?#16.3 R?#19.2 R?#21.2 U?#6.11(V-) U?#7.11(V-)
I420_CH1: D?#3.3 R?#18.2 ; port H_20MA_SENSORS.I420_CH1
I420_CH2: D?#4.3 R?#20.2 ; port H_20MA_SENSORS.I420_CH2
I420_IN1: J?#15.2 R?#19.1 U?#6.10(IN_C+)
I420_IN2: J?#16.2 R?#21.1 U?#7.12(IN_D+)
OP_RLIM3: R?#18.1 U?#6.8(OUT_C) U?#6.9(IN_C-)
OP_RLIM4: R?#20.1 U?#7.13(IN_D-) U?#7.14(OUT_D)

### Notes on the sheet
- Analog 4-20mA sensors
- Harness connector
- Sensor Channel 1
- Decoupling capacitors
- Sensor Channel 2

### Library data of the parts
C?#23 C?#24 = Generic C: as C?#1 on sheet mcu_core; Case Code (Imperial): 0805; Mount: Surface Mount; Depth: 1.25mm; Length: 2mm; Lead Free: Lead Free; Packaging: Tape and Reel; Width: 0.049inch; Package Quantity: 1; Height: 1.25mm; Case/Package: 0805; Thickness: 0.053inch; Max Operating Temperature: 85°C; Case Code (Metric): 2012; Contact Plating: Tin; Min Operating Temperature: -55°C; Radiation Hardening: No; Voltage Rating (DC): 10V
D?#3 D?#4 = CMP-1667-00006-2: as D?#1 on sheet analog_10V_sensors; Width: 1.3mm; Mount: Surface Mount; Height: 1mm; Number of Pins: 3; Weight: 0.000282oz; Max Reverse Voltage (DC): 30V; Max Power Dissipation: 200mW; Lead Free: Lead Free; Max Operating Temperature: 150°C; Min Operating Temperature: -65°C; Package Quantity: 3000; REACH SVHC: No SVHC; Termination: SMD/SMT; Max Forward Surge Current (Ifsm): 600mA; Radiation Hardening: No; Voltage Rating (DC): 30V; Average Rectified Current: 200mA; Max Repetitive Reverse Voltage (Vrrm): 30V; Contact Plating: Tin; Case/Package: SOT-23; Forward Current: 200mA; Power Dissipation: 200mW; Length: 2.9mm; Packaging: Tape and Reel
J?#15 J?#16 = CMP-1502-03325-2: NexarPartId: 78871138; Number of Pins: 3; Packaging: Box; RoHS: Non-Compliant; Lead Pitch: 5mm
R?#18-R?#21 = Generic R
U?#6 U?#7 = CMP-0272-00094-3: as U?#4 on sheet analog_10V_sensors; ComponentLink2URL: http://www.ti.com/general/docs/lit/getliterature.tsp?genericPartNumber=OPA4330&fileType=pdf; PackageReference: D0014A; ComponentLink1Description: Manufacturer URL; ComponentLink1URL: http://www.ti.com/; PartNumber: OPA4330AID; ComponentLink2Description: Datasheet; DatasheetVersion: SBOS432E; Eco-Plan: Green (RoHS & no Sb/Br); ComponentLink3URL: http://www.ti.com/lit/ml/mpds177g/mpds177g.pdf; Mounting Technology: Surface Mount; ComponentLink3Description: Package Specification; PackageVersion: 4040047-5/M, 06/2011; PackageDescription: 14-Pin Plastic Small Outline, Body 8.65 x 3.9 mm, Pitch 1.27 mm; Code_JEDEC: MS-012

## Sheet wifi_module.SchDoc
size A4; SheetNumber: 12; SheetTotal: 12
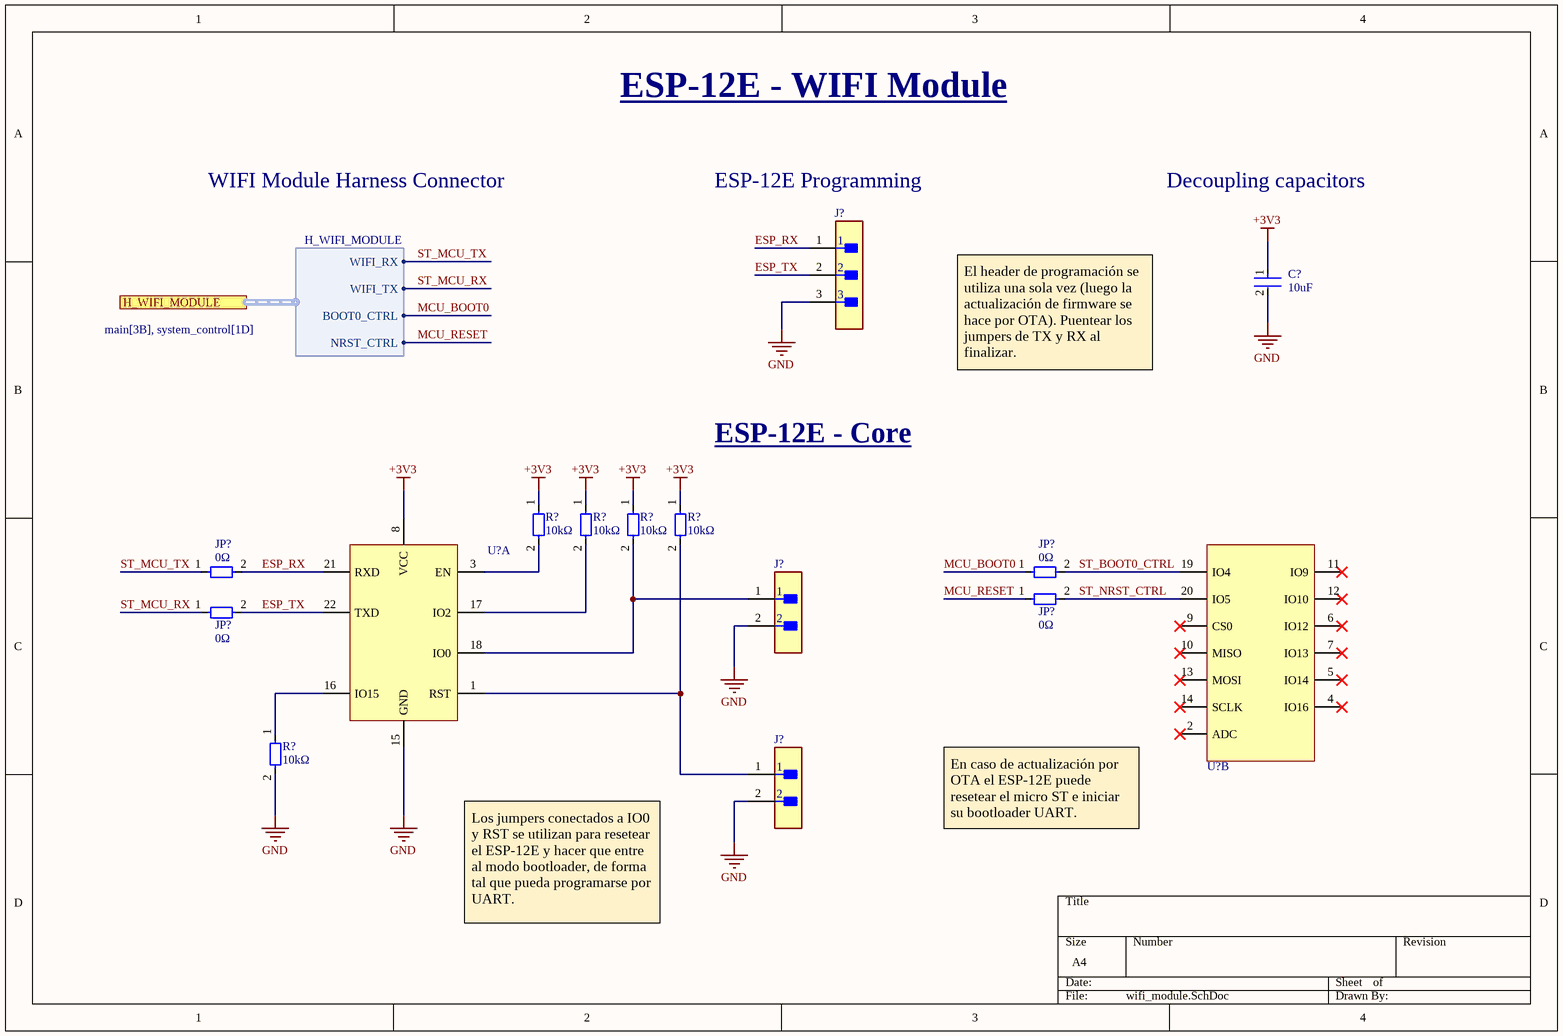
[diagram p9: wifi_module.SchDoc]

### Parts
(Parts that share a designator on the sheet are numbered #1, #2 ... from top to bottom, then left to right.)
C?#25  Capacitance: 10uF  [CAP_0805]  (hidden comment: Simbolo de capacitor genérico)
J?#17  22-11-1031  [FP-0022111031-MFG]  (value not drawn)
J?#18  4-103185-0-02  [FP-4-103185-0-02-MFG]  (value not drawn)
J?#19  4-103185-0-02  [FP-4-103185-0-02-MFG]  (value not drawn)
JP?#1  value 0Ω  [RES_0R_0603]  (hidden comment: Generic JP)  (no BOM)
JP?#2  value 0Ω  [RES_0R_0603]  (hidden comment: Generic JP)  (no BOM)
JP?#3  value 0Ω  [RES_0R_0603]  (hidden comment: Generic JP)  (no BOM)
JP?#4  value 0Ω  [RES_0R_0603]  (hidden comment: Generic JP)  (no BOM)
R?#22  value 10kΩ  [RES_0805]  (hidden comment: Simbolo de resistencia genérica)
R?#23  value 10kΩ  [RES_0805]  (hidden comment: Simbolo de resistencia genérica)
R?#24  value 10kΩ  [RES_0805]  (hidden comment: Simbolo de resistencia genérica)
R?#25  value 10kΩ  [RES_0805]  (hidden comment: Simbolo de resistencia genérica)
R?#26  value 10kΩ  [RES_0805]  (hidden comment: Simbolo de resistencia genérica)
U?#8  ESP-12E module  [ESP-12E]  (value not drawn)  (part A of 2)
U?#9  ESP-12E module  [ESP-12E]  (value not drawn)  (part B of 2)

### Ports
H_WIFI_MODULE (harness H_WIFI_MODULE, see main[3B], system_control[1D])

### Harnesses
H_WIFI_MODULE: WIFI_TX, WIFI_RX, BOOT0_CTRL, NRST_CTRL

### Nets
+3V3: C?#25.1 R?#22.1 R?#23.1 R?#24.1 R?#25.1 U?#8.8(VCC)
GND: C?#25.2 J?#17.3 J?#18.2 J?#19.2 R?#26.2 U?#8.15(GND)
ESP_RX: J?#17.1 JP?#1.2 U?#8.21(RXD)
ESP_TX: J?#17.2 JP?#4.2 U?#8.22(TXD)
MCU_BOOT0: JP?#2.1 ; port H_WIFI_MODULE.BOOT0_CTRL
MCU_RESET: JP?#3.1 ; port H_WIFI_MODULE.NRST_CTRL
ST_BOOT0_CTRL: JP?#2.2 U?#9.19(IO4)
ST_MCU_RX: JP?#4.1 ; port H_WIFI_MODULE.WIFI_TX
ST_MCU_TX: JP?#1.1 ; port H_WIFI_MODULE.WIFI_RX
ST_NRST_CTRL: JP?#3.2 U?#9.20(IO5)
NetJ?#18_1: J?#18.1 R?#24.2 U?#8.18(IO0)
NetJ?#19_1: J?#19.1 R?#25.2 U?#8.1(RST)
NetR?#22_2: R?#22.2 U?#8.3(EN)
NetR?#23_2: R?#23.2 U?#8.17(IO2)
NetR?#26_1: R?#26.1 U?#8.16(IO15)

Not connected (* = marked no-connect by the designer): U?#9 2(ADC)* 4(IO16)* 5(IO14)* 6(IO12)* 7(IO13)* 9(CS0)* 10(MISO)* 11(IO9)* 12(IO10)* 13(MOSI)* 14(SCLK)*

### Notes on the sheet
- ESP-12E - WIFI Module
- WIFI Module Harness Connector
- ESP-12E Programming
- Decoupling capacitors
- El header de programación se utiliza una sola vez (luego la actualización de firmware se hace por OTA). Puentear los jumpers de TX y RX al finalizar.
- ESP-12E - Core
- En caso de actualización por OTA el ESP-12E puede resetear el micro ST e iniciar su bootloader UART.
- Los jumpers conectados a IO0 y RST se utilizan para resetear el ESP-12E y hacer que entre al modo bootloader, de forma tal que pueda programarse por UART.

### Library data of the parts
C?#25 = Generic C: as C?#1 on sheet mcu_core; Case Code (Imperial): 0805; Mount: Surface Mount; Depth: 1.25mm; Length: 2mm; Lead Free: Lead Free; Packaging: Tape and Reel; Width: 0.049inch; Package Quantity: 1; Height: 1.25mm; Case/Package: 0805; Thickness: 0.053inch; Max Operating Temperature: 85°C; Case Code (Metric): 2012; Contact Plating: Tin; Min Operating Temperature: -55°C; Radiation Hardening: No; Voltage Rating (DC): 10V
J?#17 = CMP-00257-00247512-1: 22-11-1031 Mini-Latch™ Wire-to-Board Header, Vertical, with Friction Ramp, 3 Circuits, Gold (Au) Plating; Manufacturer Lifecycle Status: ACTIVE; NexarPartId: 247512; Number of Positions: 3; Current Rating: 3A; Gender: Male; Pitch: 2.5mm; Connector Type: Male Pin; Contact Resistance: 20mΩ; Voltage Rating: 250V; Max Voltage Rating (DC): 250.25kV; Color: Natural; Fastening Type: Friction; RoHS: Compliant; Contact Mating Length: 7.493mm; Lifecycle Status: Production; Number of Rows: 1; Schedule B: 8536694040, 8536694040; Radiation Hardening: No; Number of Contacts: 3; Depth: 4.9mm; Termination: Solder; Housing Color: Natural; Max Operating Temperature: 105°C; Mount: Through Hole; Height: 12.1mm; Lead Free: Lead Free; Contact Gender: Male; Plating: Gold; Contact Material: Brass; Length: 7mm; Country of Origin: KR; Housing Material: Nylon; Number of Circuits: 3; Contact Plating: Gold; Packaging: Bulk; Orientation: Vertical; Min Operating Temperature: -40°C; REACH SVHC: Unknown
J?#18 J?#19 = CMP-06573-39509931-1: 4-103185-0-02 Conn Header Vert 2POS 2.54MM; Connector Type: Male Pin; Number of Contacts: 2; Gender: Male; Width: 2.34mm; Contact Plating: Gold; Number of Rows: 1; Pitch: 2.54mm; Termination: Solder; Housing Color: Black; Mount: Through Hole; Contact Mating Length: 5.842mm; Housing Material: Plastic; Length: 4.67mm; Number of Positions: 2; Packaging: Bulk; NexarPartId: 39509931; Contact Material: Bronze; Lead Free: Contains Lead; Case/Package: 100; Color: Black; RoHS: Non-Compliant; Height: 2.29mm
JP?#1-JP?#4 = Generic JP: Simbolo de jumper genérico
R?#22-R?#26 = Generic R
U?#8 U?#9 = ESP-12E: Wi-Fi module ESP-12E 3.3V.; Value: ESP-12E; LCSC Part #: C89297; Datasheet: https://components101.com/sites/default/files/2021-09/ESP12E-Datasheet.pdf

## Sheet actuators.SchDoc
size A4; SheetNumber: 10; SheetTotal: 13
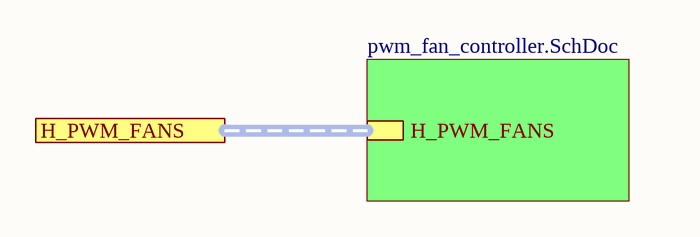
[diagram p10: actuators.SchDoc]

### Sub-sheets
pwm_fan_controller = pwm_fan_controller.SchDoc: H_PWM_FANS (harness H_PWM_FANS)

### Ports
H_PWM_FANS (harness H_PWM_FANS)

### Buses and harness runs
harness port H_PWM_FANS = sheet pwm_fan_controller/H_PWM_FANS

## Sheet pwm_fan_controller.SchDoc
size A4; SheetNumber: 10; SheetTotal: 12
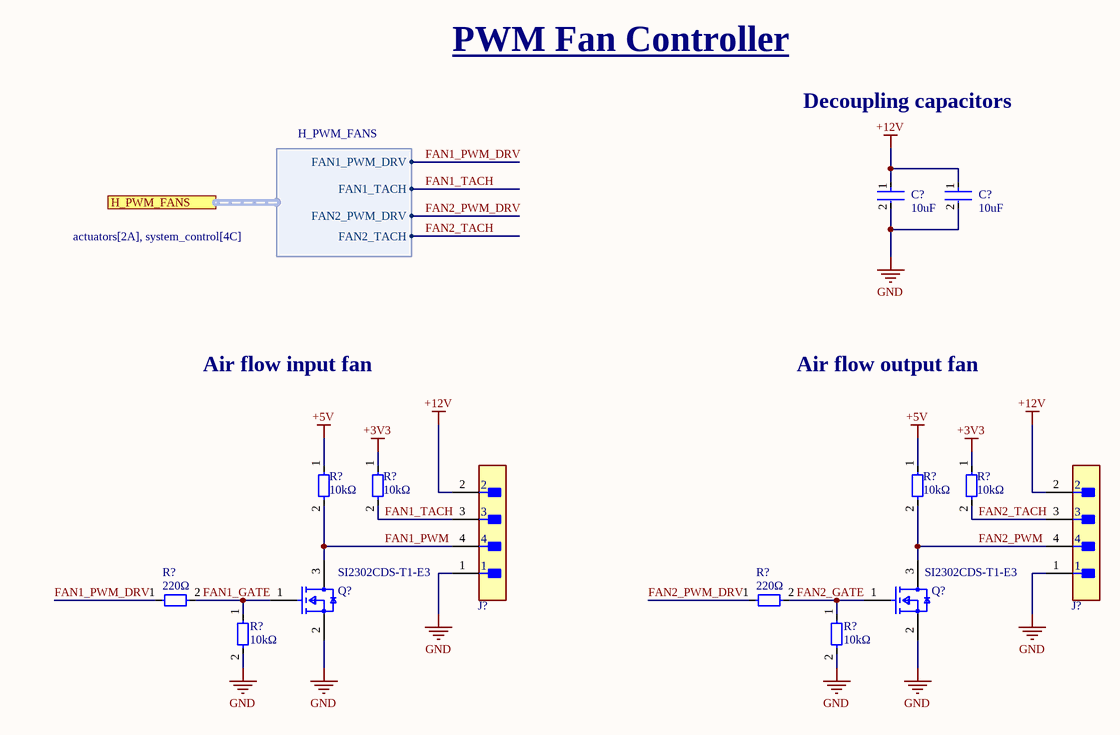
[diagram p11: pwm_fan_controller.SchDoc]

### Parts
(Parts that share a designator on the sheet are numbered #1, #2 ... from top to bottom, then left to right.)
C?#26  Capacitance: 10uF  [CAP_0805]  (hidden comment: Simbolo de capacitor genérico)
C?#27  Capacitance: 10uF  [CAP_0805]  (hidden comment: Simbolo de capacitor genérico)
J?#20  22-29-2041  [CONN_MOLEX_KK_4POS_2,54]  (value not drawn)
J?#21  22-29-2041  [CONN_MOLEX_KK_4POS_2,54]  (value not drawn)
Q?#1  SI2302CDS-T1-E3  [FP-S-03946-MFG]
Q?#2  SI2302CDS-T1-E3  [FP-S-03946-MFG]
R?#27  value 10kΩ  [RES_0805]  (hidden comment: Simbolo de resistencia genérica)
R?#28  value 10kΩ  [RES_0805]  (hidden comment: Simbolo de resistencia genérica)
R?#29  value 10kΩ  [RES_0805]  (hidden comment: Simbolo de resistencia genérica)
R?#30  value 10kΩ  [RES_0805]  (hidden comment: Simbolo de resistencia genérica)
R?#31  value 220Ω  [RES_0805]  (hidden comment: Simbolo de resistencia genérica)
R?#32  value 220Ω  [RES_0805]  (hidden comment: Simbolo de resistencia genérica)
R?#33  value 10kΩ  [RES_0805]  (hidden comment: Simbolo de resistencia genérica)
R?#34  value 10kΩ  [RES_0805]  (hidden comment: Simbolo de resistencia genérica)

### Ports
H_PWM_FANS (harness H_PWM_FANS, see actuators[2A], system_control[4C])

### Harnesses
H_PWM_FANS: FAN1_PWM_DRV, FAN1_TACH, FAN2_PWM_DRV, FAN2_TACH

### Nets
+3V3: R?#28.1 R?#30.1
+5V: R?#27.1 R?#29.1
+12V: C?#26.1 C?#27.1 J?#20.2 J?#21.2
GND: C?#26.2 C?#27.2 J?#20.1 J?#21.1 Q?#1.2(S) Q?#2.2(S) R?#33.2 R?#34.2
FAN1_GATE: Q?#1.1(G) R?#31.2 R?#33.1
FAN1_PWM: J?#20.4 Q?#1.3(D) R?#27.2
FAN1_PWM_DRV: R?#31.1 ; port H_PWM_FANS.FAN1_PWM_DRV
FAN1_TACH: J?#20.3 R?#28.2 ; port H_PWM_FANS.FAN1_TACH
FAN2_GATE: Q?#2.1(G) R?#32.2 R?#34.1
FAN2_PWM: J?#21.4 Q?#2.3(D) R?#29.2
FAN2_PWM_DRV: R?#32.1 ; port H_PWM_FANS.FAN2_PWM_DRV
FAN2_TACH: J?#21.3 R?#30.2 ; port H_PWM_FANS.FAN2_TACH

### Notes on the sheet
- PWM Fan Controller
- Decoupling capacitors
- Air flow input fan
- Air flow output fan

### Library data of the parts
C?#26 C?#27 = Generic C: as C?#1 on sheet mcu_core; Case Code (Imperial): 0805; Mount: Surface Mount; Depth: 1.25mm; Length: 2mm; Lead Free: Lead Free; Packaging: Tape and Reel; Width: 0.049inch; Package Quantity: 1; Height: 1.25mm; Case/Package: 0805; Thickness: 0.053inch; Max Operating Temperature: 85°C; Case Code (Metric): 2012; Contact Plating: Tin; Min Operating Temperature: -55°C; Radiation Hardening: No; Voltage Rating (DC): 10V
J?#20 J?#21 = CONN_MOLEX_KK_4POS_2,54MM_ALT: CONN HEADER VERT 4POS 2.54MM MOLEX KK; Insulation Resistance: 50GR; Voltage Rating: 250V; Glow Wire Compliant: Non-compliant; Max Current Rating: 4A; Number of Circuits: 4; Contact Resistance: 10mR; Gender: Male; Number of Lines: 1; Length: 10.16mm; Radiation Hardening: No; Pitch: 2.54mm; Contact Material: Brass; Height: 11.7mm; Max Operating Temperature: 75°C; Flammability Rating: UL94 V-0; Mount: Through Hole; Voltage Rating (DC): 250V; Halogen Free: Low Halogen; Housing Color: White; Package Quantity: 1500; Series: KK® 6410; Number of Rows: 1; Housing Material: Nylon; Depth: 5.8mm; RoHS Compliant: Yes; Orientation: Straight; Contact Gender: Male; Color: Natural; Current Rating: 4A; Contact Mating Length: 0.295inch; Number of Poles: 4; Packaging: Bulk; Contact Type: Male Pin; Termination: Solder; Number of Positions: 4; Number of Contacts: 4; Lead Free: Lead Free; Min Operating Temperature: 0°C; Fastening Type: Friction; Contact Plating: Gold
Q?#1 Q?#2 = CMP-02550-000184-1: MOSFET N-CH 20V 2.6A SOT-23; Manufacturer: Vishay; Gate To Source Voltage: 8V; Max Forward Diode Voltage: 1.2V; Pulse Drain Current: 10A; Typ Forward Diode Voltage: 0.7V; Number Of N Channels: 1; Reverse Recovery Charge: 2nC; Power Dissipation: 0.71W; Reverse Recovery Time: 8.5ns; Threshold Vgs Min: 0.4V; Drain To Source Resistance: 0.045Ω; Gate Charge At Vgs: 3.5nC @ 4.5V; Turn Off Delay Time: 30ns; Rthja Max: 140°C/W; Max Junction Temp: +150°C; Transconductance: 13S; Depletion Mode: False; Standoff Height: 0.01mm; Turn On Delay Time: 8ns; Threshold Vgs Max: 0.85V; Manufacturer Part Number: SI2302CDS-T1-E3; Mouser Description: MOSFET 20V 2.9A 0.86W 57mohm @ 4.5V; Digikey Description: MOSFET N-CH 20V 2.6A SOT-23; Drain To Source Voltage: 20V; Lead Free: Yes; Temperature Range High: +150°C; Automotive: No; ComponentLink2URL: http://www.vishay.com/docs/68645/si2302cds.pdf; Height: 1.12mm; ComponentLink2Description: Datasheet; Octopart: https://octopart.com/si2302cds-t1-e3-vishay-44452855; Continuous Drain Current: 2.6A; Drain To Source Breakdown Voltage: 20V; Number Of Channels: 1; Device Class L3: MOSFETs; Device Class L1: Discrete Semiconductors; Temperature Range Low: -55°C; Package: S-03946; RoHS: TRUE; Device Class L2: Transistors; Temperature: -55°C to +150°C; Category: Trans
R?#27-R?#34 = Generic R

## Sheet datalogging.SchDoc
size A4; SheetNumber: 11; SheetTotal: 12
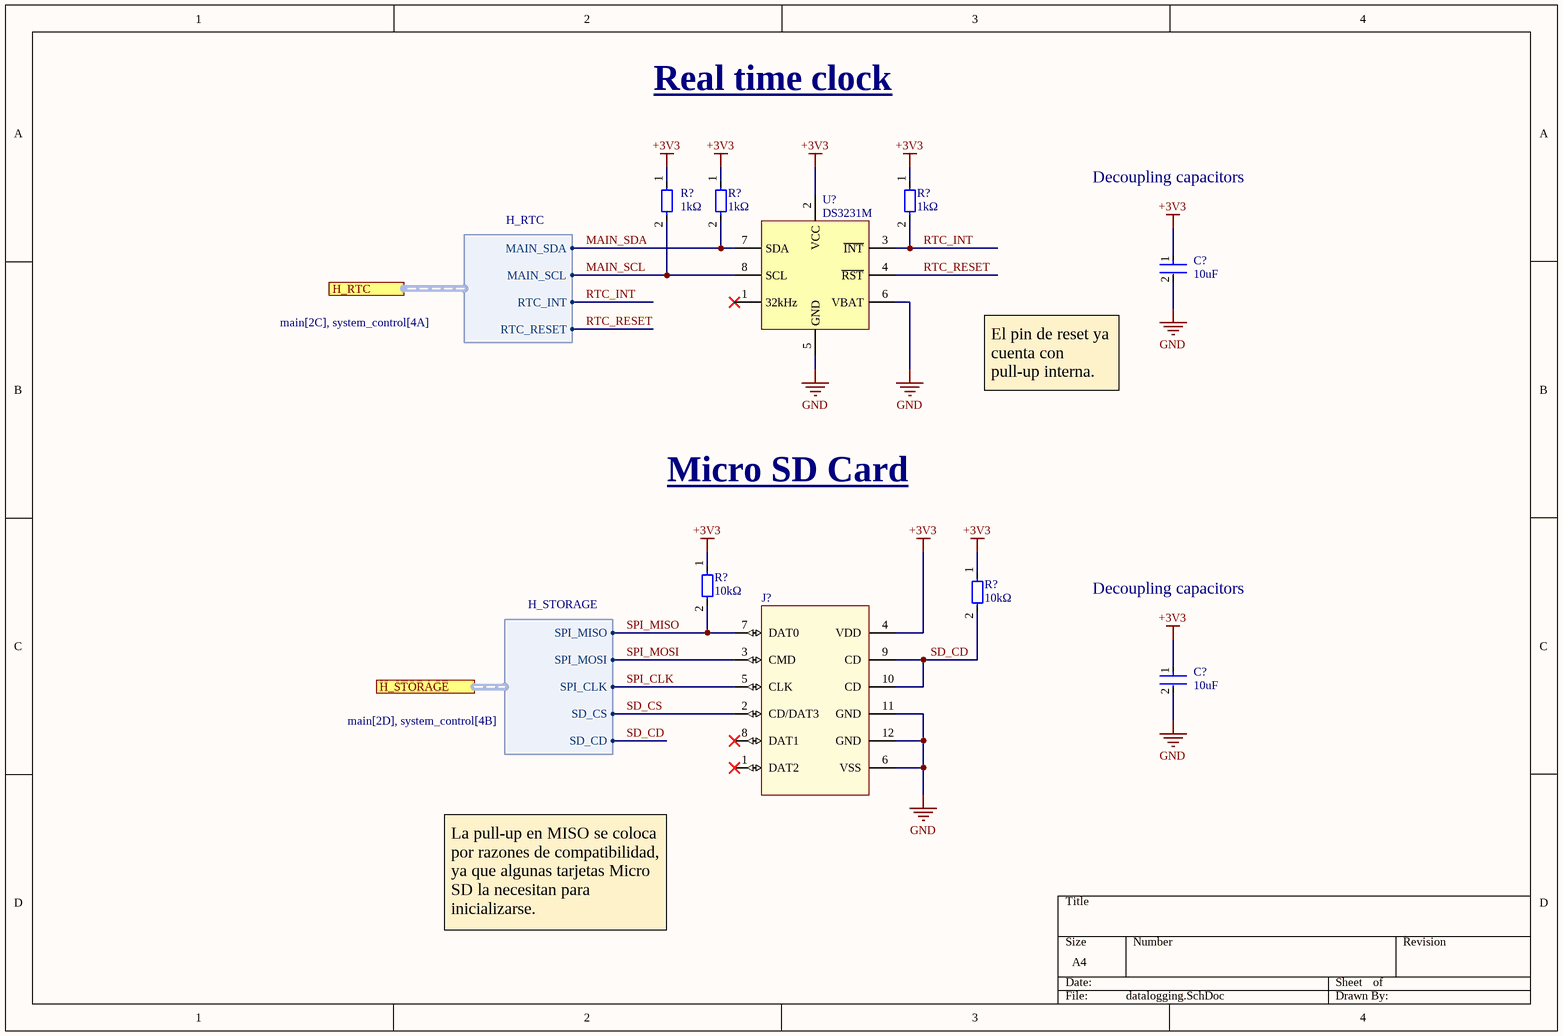
[diagram p12: datalogging.SchDoc]

### Parts
(Parts that share a designator on the sheet are numbered #1, #2 ... from top to bottom, then left to right.)
C?#28  Capacitance: 10uF  [CAP_0805]  (hidden comment: Simbolo de capacitor genérico)
C?#29  Capacitance: 10uF  [CAP_0805]  (hidden comment: Simbolo de capacitor genérico)
J?#22  MEM2061-01-188-00-A_revA  [MEM2061-01-188-00-A_revA]  (value not drawn)
R?#35  value 1kΩ  [RES_0805]  (hidden comment: Simbolo de resistencia genérica)
R?#36  value 1kΩ  [RES_0805]  (hidden comment: Simbolo de resistencia genérica)
R?#37  value 1kΩ  [RES_0805]  (hidden comment: Simbolo de resistencia genérica)
R?#38  value 10kΩ  [RES_0805]  (hidden comment: Simbolo de resistencia genérica)
R?#39  value 10kΩ  [RES_0805]  (hidden comment: Simbolo de resistencia genérica)
U?#10  DS3231M  [SOIC8]

### Ports
H_RTC (harness H_RTC, see main[2C], system_control[4A]), H_STORAGE (harness H_STORAGE, see main[2D], system_control[4B])

### Harnesses
H_RTC: MAIN_SDA, MAIN_SCL, RTC_INT, RTC_RESET
H_STORAGE: SPI_MISO, SPI_MOSI, SPI_CLK, SD_CS, SD_CD

### Nets
+3V3: C?#28.1 C?#29.1 J?#22.4(VDD) R?#35.1 R?#36.1 R?#37.1 R?#38.1 R?#39.1 U?#10.2(VCC)
GND: C?#28.2 C?#29.2 J?#22.6(VSS) J?#22.11(GND) J?#22.12(GND) U?#10.5(GND) U?#10.6(VBAT)
MAIN_SCL: R?#35.2 U?#10.8(SCL) ; port H_RTC.MAIN_SCL
MAIN_SDA: R?#36.2 U?#10.7(SDA) ; port H_RTC.MAIN_SDA
RTC_INT: R?#37.2 U?#10.3(~{INT}) ; port H_RTC.RTC_INT
RTC_RESET: U?#10.4(~{RST}) ; port H_RTC.RTC_RESET
SD_CD: J?#22.9(CD) J?#22.10(CD) R?#39.2 ; port H_STORAGE.SD_CD
SD_CS: J?#22.2(CD/DAT3) ; port H_STORAGE.SD_CS
SPI_CLK: J?#22.5(CLK) ; port H_STORAGE.SPI_CLK
SPI_MISO: J?#22.7(DAT0) R?#38.2 ; port H_STORAGE.SPI_MISO
SPI_MOSI: J?#22.3(CMD) ; port H_STORAGE.SPI_MOSI

Not connected (* = marked no-connect by the designer): J?#22 1(DAT2)* 8(DAT1)*; U?#10 1(32kHz)*

### Notes on the sheet
- Real time clock
- Decoupling capacitors
- El pin de reset ya cuenta con pull-up interna.
- Micro SD Card
- La pull-up en MISO se coloca por razones de compatibilidad, ya que algunas tarjetas Micro SD la necesitan para inicializarse.

### Library data of the parts
C?#28 C?#29 = Generic C: as C?#1 on sheet mcu_core; Case Code (Imperial): 0805; Mount: Surface Mount; Depth: 1.25mm; Length: 2mm; Lead Free: Lead Free; Packaging: Tape and Reel; Width: 0.049inch; Package Quantity: 1; Height: 1.25mm; Case/Package: 0805; Thickness: 0.053inch; Max Operating Temperature: 85°C; Case Code (Metric): 2012; Contact Plating: Tin; Min Operating Temperature: -55°C; Radiation Hardening: No; Voltage Rating (DC): 10V
J?#22 = MEM2061-01-188-00-A_revA: Micro SD Memory Card Connector, 1.88mm Profile SMT,Push Push, with normally closed switch; Manufacturer: GCT; Insertion, Removal Method: Push In, Push Out; MPN: MEM2061-01-188-00-A; Mounting Type: Surface Mount, Right Angle; Datasheet: https://gct.co/files/specs/mem2061-spec.pdf
R?#35-R?#39 = Generic R
U?#10 = DS3231M: Real Time Clock (RTC) IC Clock/Calendar I2C, 2-Wire Serial 8-SOIC (0.154", 3.90mm Width); Manufacturer: Analog Devices; MPN: DS3231MZ+TRL; Voltage - Supply: 2.3V ~ 5.5V; Current - Timekeeping (Max): 130µA ~ 200µA @ 3.63V ~ 5.5V; Interface: I2C; Features: Alarm, Leap Year, Square Wave Output; Voltage - Supply, Battery: 2.3V ~ 5.5V; Operating Temperature: -40°C ~ 85°C; Package: 8-SOIC; Datasheet: https://www.analog.com/media/en/technical-documentation/data-sheets/DS3231M.pdf

## Nets that join several sheets
+3V3: mcu_core (15 pins), rs485_sensors (C?#12.1 U?#3.8), level_switches (R?#4.1 R?#5.1 R?#6.1), i2c_sensors (8 pins), analog_10V_sensors (5 pins), analog_20mA_sensors (D?#3.2 D?#4.2 U?#6.4 U?#7.4), wifi_module (6 pins), pwm_fan_controller (R?#28.1 R?#30.1), datalogging (9 pins)
+12V: analog_10V_sensors (J?#13.1 J?#14.1), analog_20mA_sensors (C?#23.1 C?#24.1 J?#15.1 J?#16.1), pwm_fan_controller (C?#26.1 C?#27.1 J?#20.2 J?#21.2)
+24V: rs485_sensors (8 pins), analog_10V_sensors (C?#21.1 C?#22.1)
GND: mcu_core (22 pins), rs485_sensors (10 pins), level_switches (6 pins), i2c_sensors (J?#9.5 J?#10.5 J?#11.5 J?#12.5), analog_10V_sensors (11 pins), analog_20mA_sensors (10 pins), wifi_module (6 pins), pwm_fan_controller (8 pins), datalogging (7 pins)
MCU_SWCLK: system_control (U?#1.49), mcu_core (J?#1.3)
MCU_SWDIO: system_control (U?#1.46), mcu_core (J?#1.2)